# Altium project Abstract Hardware Device.PrjPcb
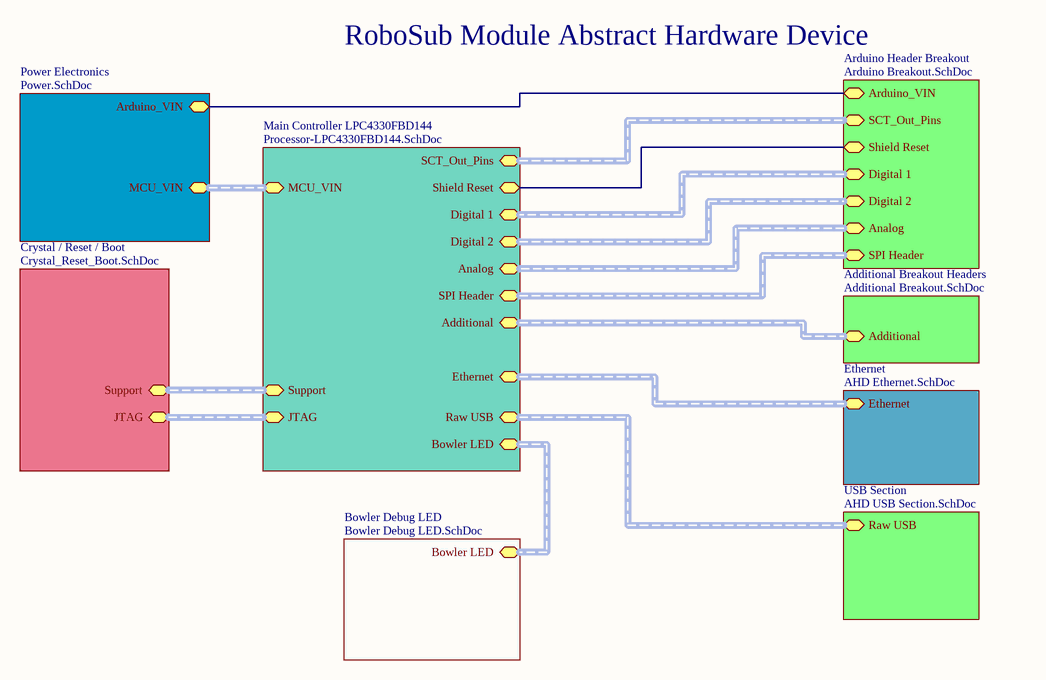
[diagram p0: AHD Master Schematic.SchDoc]
9 sheets, 162 parts. Net scope: hierarchical (ports join the sheet entries above them; power ports are global).
Board file: AHD PCB R2.4.PcbDoc
Sheets:
  AHD Master Schematic.SchDoc
    Power Electronics = Power.SchDoc
    Main Controller LPC4330FBD144 = Processor-LPC4330FBD144.SchDoc
    Arduino Header Breakout = Arduino Breakout.SchDoc
    Ethernet = AHD Ethernet.SchDoc
    Crystal / Reset / Boot = Crystal_Reset_Boot.SchDoc
    USB Section = AHD USB Section.SchDoc
    Bowler Debug LED = Bowler Debug LED.SchDoc
    Additional Breakout Headers = Additional Breakout.SchDoc

## Sheet AHD Master Schematic.SchDoc: Abstract Hardware Device Master Sheet
size A; DrawnBy: Adam Vadala-Roth; DocumentNumber: 1; Revision: 2.3b; SheetNumber: 1; SheetTotal: 9

### Sub-sheets
Additional Breakout Headers = Additional Breakout.SchDoc: Additional (harness Additional)
Arduino Header Breakout = Arduino Breakout.SchDoc: Analog (harness Analog), Digital 1 (harness Digital 1), Digital 2 (harness Digital 2), Arduino_VIN, SCT_Out_Pins (harness SCT_Out_Pins), SPI Header (harness SPI_Header), Shield Reset
Bowler Debug LED = Bowler Debug LED.SchDoc: Bowler LED (harness Bowler LED)
Crystal / Reset / Boot = Crystal_Reset_Boot.SchDoc: JTAG (harness JTAG), Support (harness Support)
Ethernet = AHD Ethernet.SchDoc: Ethernet (harness Ethernet)
Main Controller LPC4330FBD144 = Processor-LPC4330FBD144.SchDoc: Digital 2 (harness Digital 2), Digital 1 (harness Digital 1), Analog (harness Analog), Ethernet, JTAG (harness JTAG), MCU_VIN (harness MCU_VIN), Bowler LED (harness Bowler LED), Additional (harness Additional), SCT_Out_Pins (harness SCT_Out_Pins), SPI Header (harness SPI_Header), Support (harness Support), Raw USB (harness Raw USB), Shield Reset
Power Electronics = Power.SchDoc: MCU_VIN (harness MCU_VIN), Arduino_VIN
USB Section = AHD USB Section.SchDoc: Raw USB (harness Raw USB)

### Nets
VCC_IN: sheet Power Electronics/Arduino_VIN, sheet Arduino Header Breakout/Arduino_VIN
RESET: sheet Main Controller LPC4330FBD144/Shield Reset, sheet Arduino Header Breakout/Shield Reset

### Buses and harness runs
harness sheet Additional Breakout Headers/Additional = sheet Main Controller LPC4330FBD144/Additional
harness sheet Arduino Header Breakout/Analog = sheet Main Controller LPC4330FBD144/Analog
harness sheet Arduino Header Breakout/Digital 1 = sheet Main Controller LPC4330FBD144/Digital 1
harness sheet Arduino Header Breakout/Digital 2 = sheet Main Controller LPC4330FBD144/Digital 2
harness sheet Arduino Header Breakout/SCT_Out_Pins = sheet Main Controller LPC4330FBD144/SCT_Out_Pins
harness sheet Arduino Header Breakout/SPI Header = sheet Main Controller LPC4330FBD144/SPI Header
harness sheet Bowler Debug LED/Bowler LED = sheet Main Controller LPC4330FBD144/Bowler LED
harness sheet Crystal / Reset / Boot/JTAG = sheet Main Controller LPC4330FBD144/JTAG
harness sheet Crystal / Reset / Boot/Support = sheet Main Controller LPC4330FBD144/Support
harness sheet Ethernet/Ethernet = sheet Main Controller LPC4330FBD144/Ethernet
harness sheet Main Controller LPC4330FBD144/MCU_VIN = sheet Power Electronics/MCU_VIN
harness sheet Main Controller LPC4330FBD144/Raw USB = sheet USB Section/Raw USB

### Notes on the sheet
- RoboSub Module Abstract Hardware Device

## Sheet Power.SchDoc: Board Level Power
size A; DrawnBy: Adam Vadala-Roth; DocumentNumber: 4; Revision: 2.4b; SheetNumber: 4; SheetTotal: 9
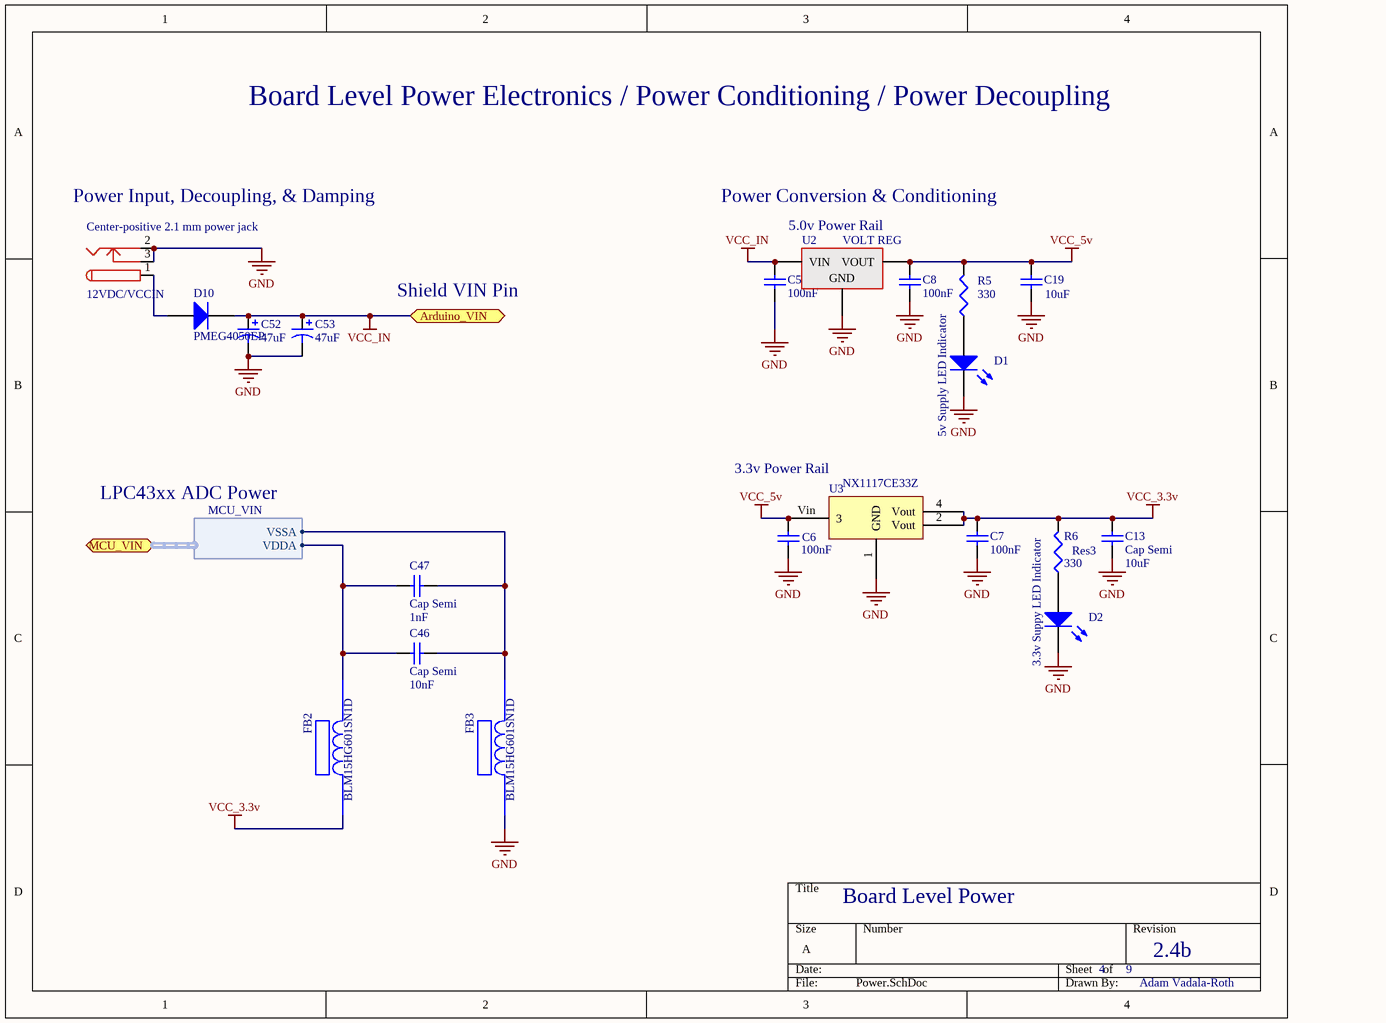
[diagram p1: Power.SchDoc]

### Parts
12VDC/VCCIN  Center-positive 2.1 mm power jack  [PJ-102AH]
C5  value 100nF  [C1206]  (hidden comment: Cap Semi)
C6  value 100nF  [C1206]  (hidden comment: Cap Semi)
C7  value 100nF  [C1206]  (hidden comment: Cap Semi)
C8  value 100nF  [C1206]  (hidden comment: Cap Semi)
C13  Cap Semi  value 10uF  [C1206]
C19  value 10uF  [C1206]  (hidden comment: Cap Semi)
C46  Cap Semi  value 10nF  [1608[0603]]
C47  Cap Semi  value 1nF  [1608[0603]]
C52  value 47uF  [CAPPR2.5-6.3x5]  (hidden comment: Cap Pol1)
C53  value 47uF  [CAPPR2.5-6.3x5]  (hidden comment: Cap Pol1)
D1  LED2  [3.2X1.6X1.1]  (value not drawn)
D2  LED2  [3.2X1.6X1.1]  (value not drawn)
D10  PMEG4050EP  [PMEG4050EP]
FB2  BLM15HG601SN1D  [BLM18PG121SN1D]
FB3  BLM15HG601SN1D  [BLM18PG121SN1D]
R5  value 330  [0805 SMD Resistor]  (hidden comment: Res3)
R6  Res3  value 330  [0805 SMD Resistor]
U2  VOLT REG  [DPAK-3]
U3  NX1117CE33Z  [NX1117CE33Z]

### Ports
Arduino_VIN, MCU_VIN (harness MCU_VIN)

### Harnesses
MCU_VIN: VDDA, VSSA

### Nets
GND: 12VDC/VCCIN.2 12VDC/VCCIN.3 C5.1 C6.1 C7.1 C8.1 C13.1 C19.1 C52.2 C53.2 D1.2(K) D2.2(K) FB3.1 U2.2(GND) U3.1(GND)
VCC_3.3v: C7.2 C13.2 FB2.1 R6.2 U3.2(Vout) U3.4(Vout)
VCC_5v: C6.2 C8.2 C19.2 R5.2 U2.3(VOUT) U3.Vin(3)
VCC_IN: C5.2 C52.1 C53.1 D10.2(K) U2.1(VIN) ; port Arduino_VIN
VDDA: C46.1 C47.1 FB2.2 ; port MCU_VIN.VDDA
VSSA: C46.2 C47.2 FB3.2 ; port MCU_VIN.VSSA
Net12VDC/VCCIN_1: 12VDC/VCCIN.1 D10.1(A)
NetD1_1: D1.1(A) R5.1
NetD2_1: D2.1(A) R6.1

### Notes on the sheet
- Board Level Power Electronics / Power Conditioning / Power Decoupling
- (near 12VDC/VCCIN) Power Input, Decoupling, & Damping
- Power Conversion & Conditioning
- 5.0v Power Rail
- Shield VIN Pin
- 5v Supply LED Indicator
- LPC43xx ADC Power
- 3.3v Power Rail
- 3.3v Suppy LED Indicator

### Library data of the parts
12VDC/VCCIN = PWR2.5: Power jack; Published: 17-Dec-2003; DatasheetDocument: 09-May-2002; Publisher: Altium Limited; ComponentLink1Description: Manufacturer Link; ComponentLink1URL: http://domino.kycon.com/internet/Products.html
C5-C8 C13 C19 C46 C47 = Cap Semi: Capacitor (Semiconductor SIM Model); Published: 8-Jun-2000; LatestRevisionDate: 29-May-2009; LatestRevisionNote: IPC-7351 Footprint Added.; PackageReference: C1206; Publisher: Altium Limited; PackageDescription: Chip Capacitor
C52 C53 = Cap Pol1: Polarized Capacitor (Radial); Published: 8-Jun-2000; LatestRevisionDate: 17-Jul-2002; LatestRevisionNote: Re-released for DXP Platform.; PackageReference: RB7.6-15; Publisher: Altium Limited; PackageDescription: Polarized Capacitor (Radial); 2 Leads
D1 D2 = LED2: Typical RED, GREEN, YELLOW, AMBER GaAs LED; Published: 8-Jun-2000; LatestRevisionDate: 17-Jul-2002; LatestRevisionNote: Re-released for DXP Platform.; PackageVersion: Feb-2002; PackageReference: 3.2X1.6X1.1; Publisher: Altium Limited; PackageDescription: SM LED; 2 Flat Leads
D10 = Diode: Default Diode; Published: 8-Jun-2000; LatestRevisionDate: 17-Jul-2002; LatestRevisionNote: Re-released for DXP Platform.; PackageVersion: Sep-1996; PackageReference: SMC; Publisher: Altium Limited; PackageDescription: DO-214-AB/SMC; 2 C-Bend Leads; Body 7.9 x 5.9 mm, inc. leads (LxW); Code_JEDEC: DO-214-AB
R5 R6 = Res3: Resistor; Published: 8-Jun-2000; LatestRevisionDate: 29-May-2009; LatestRevisionNote: IPC-7351 Footprint Added.; PackageReference: J1-0603; Publisher: Altium Limited; PackageDescription: Chip Resistor
U2 = VOLT REG: Voltage regulator; Published: 24-Mar-1999; LatestRevisionDate: 29-May-2009; LatestRevisionNote: IPC-7351 Footprint Added.; PackageReference: D2PAK; Publisher: Altium Limited; PackageDescription: 3-Pin Transistor Outline Package 2.54 mm Pitch, 15.1 mm Lead Span
U3 = NX1117CE33Z: 3.3v Linear Regulator

## Sheet Processor-LPC4330FBD144.SchDoc: Main Processor LPC43xx (144 TQFPT)
size C; DrawnBy: Adam Vadala-Roth; DocumentNumber: 2; Revision: 2.4b; SheetNumber: 2; SheetTotal: 9; PageSetup: Record=PageOptions|CenterHorizontal=True|CenterVertical=True|PrintScale=1.00|XCorrection=1.00|YCorrection=1.00|PrintKind=1|BorderSize=5000000|LeftOffset=0|BottomOffset=0|Orientation=2|PaperLength=1000|PaperWidth=1000|Scale=100|PaperSource=7|PrintQuality=-4|MediaType=1|DitherType=10|PaperKind=Letter|PrintScaleMode=0
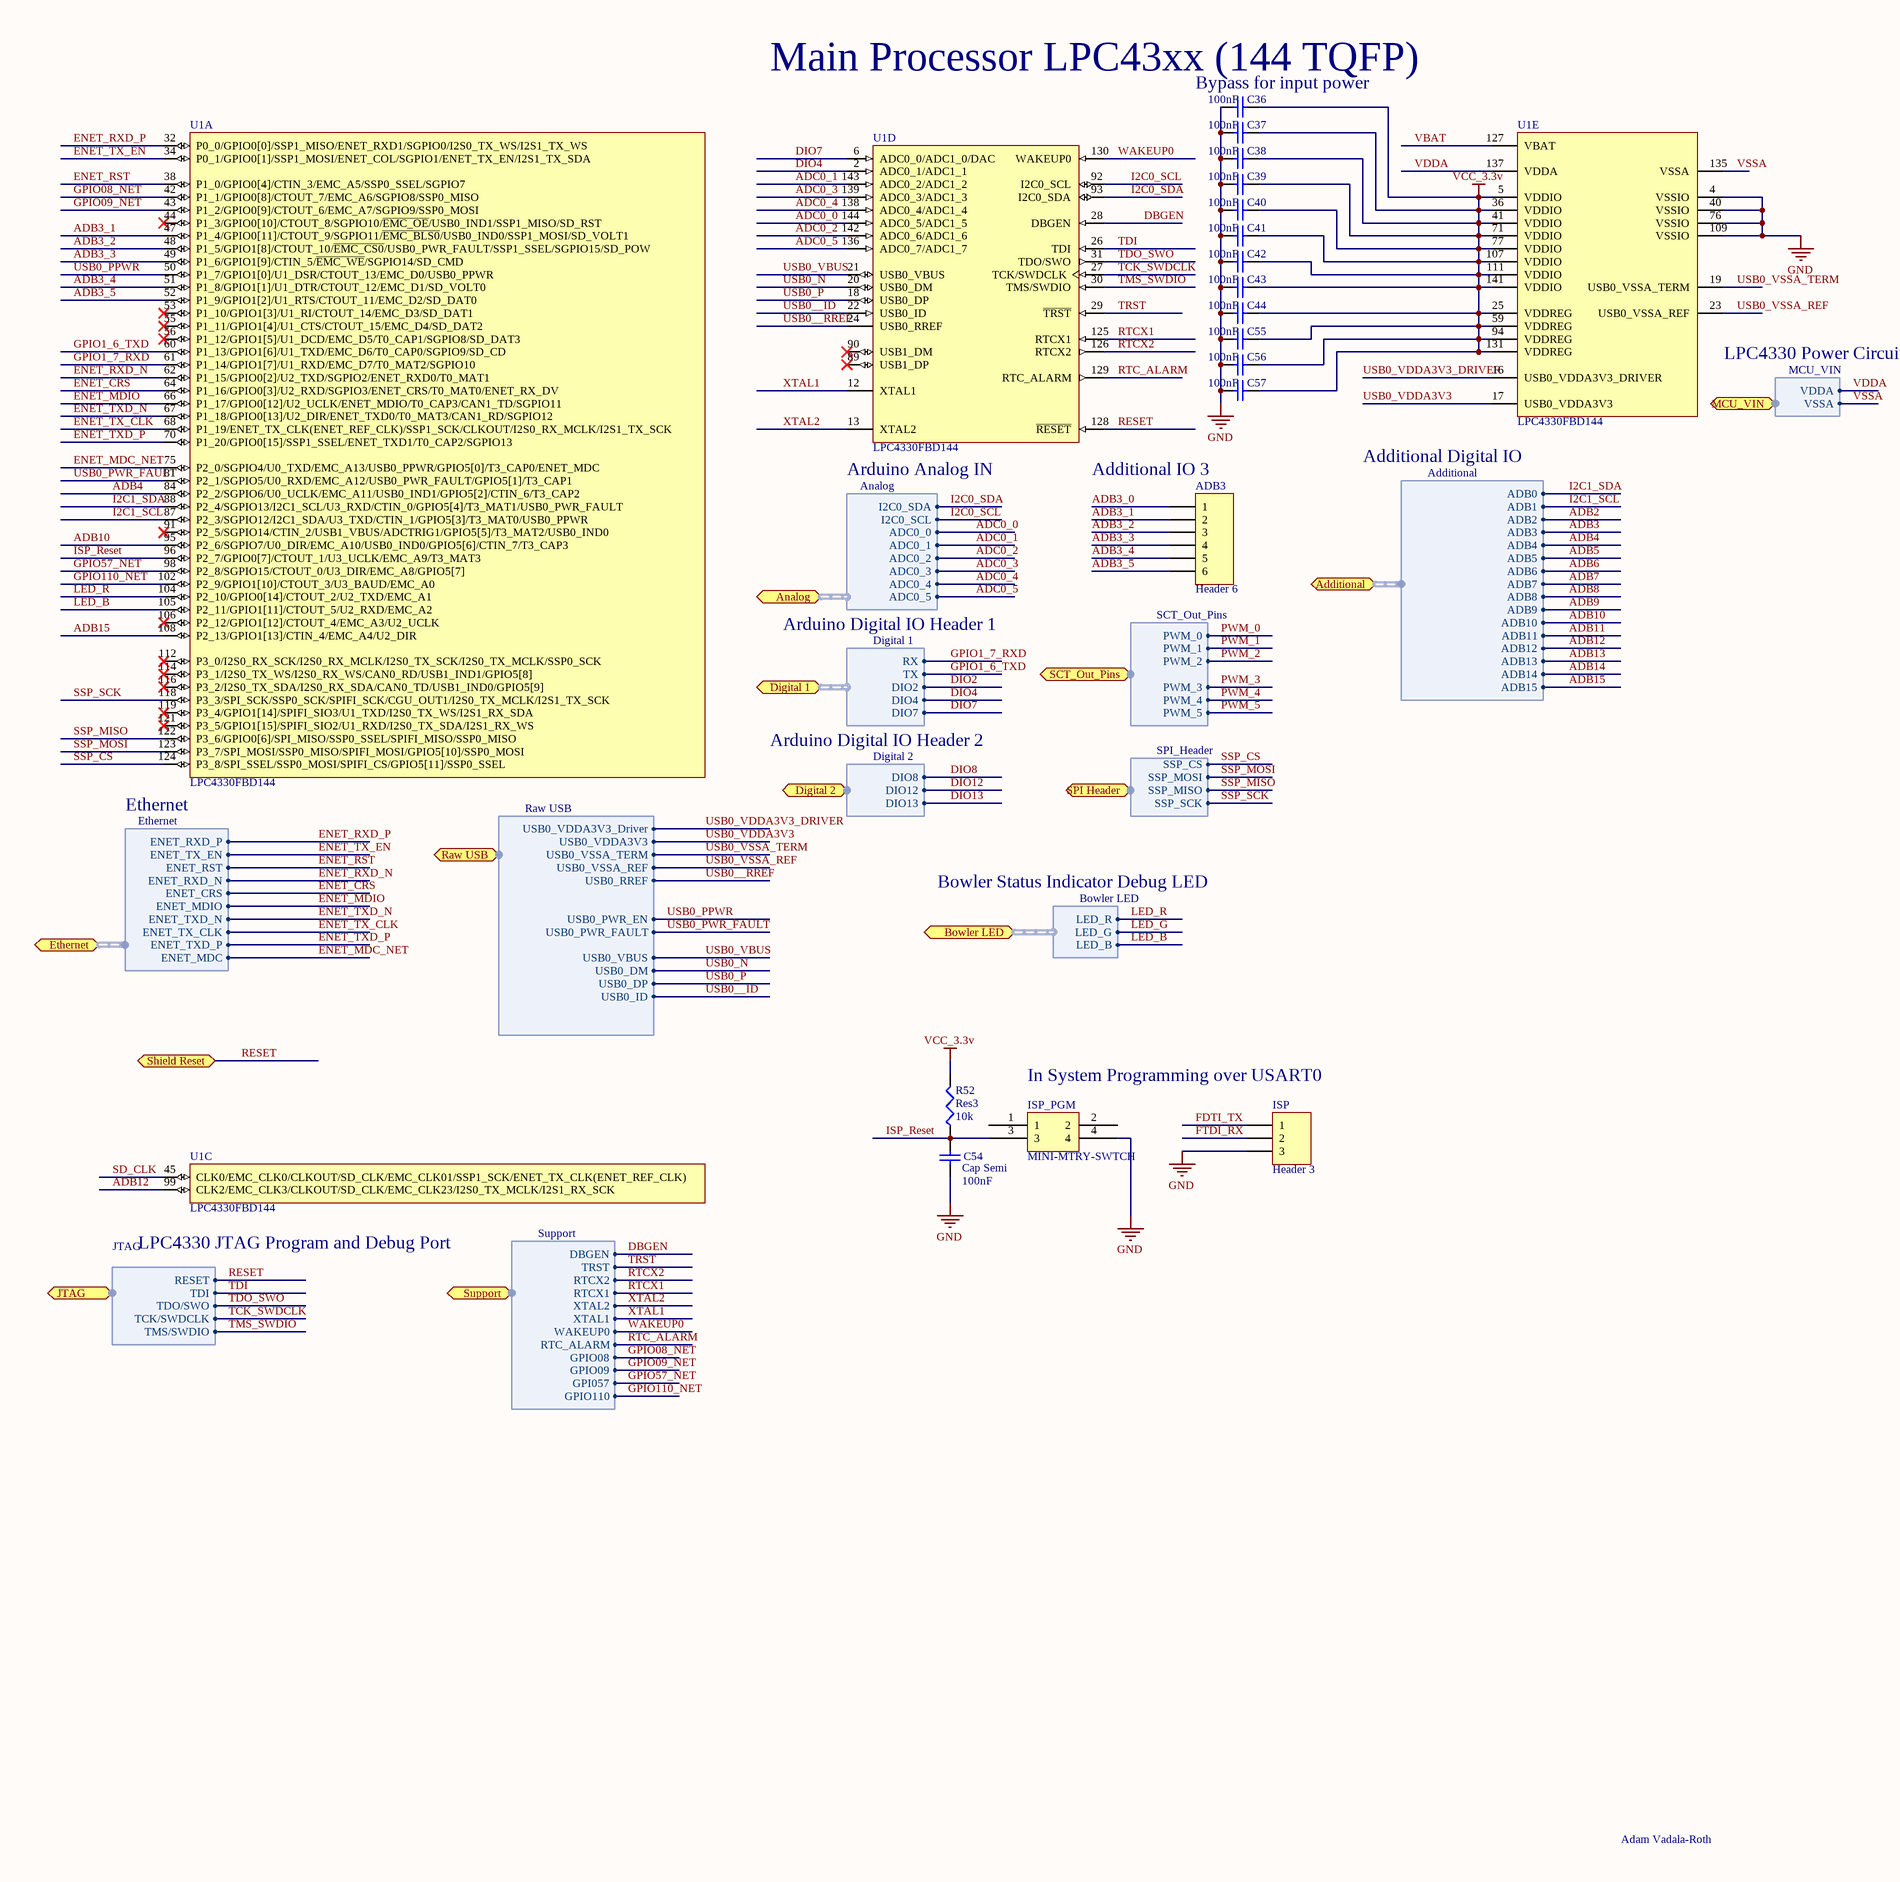
[diagram p2: Processor-LPC4330FBD144.SchDoc, left]
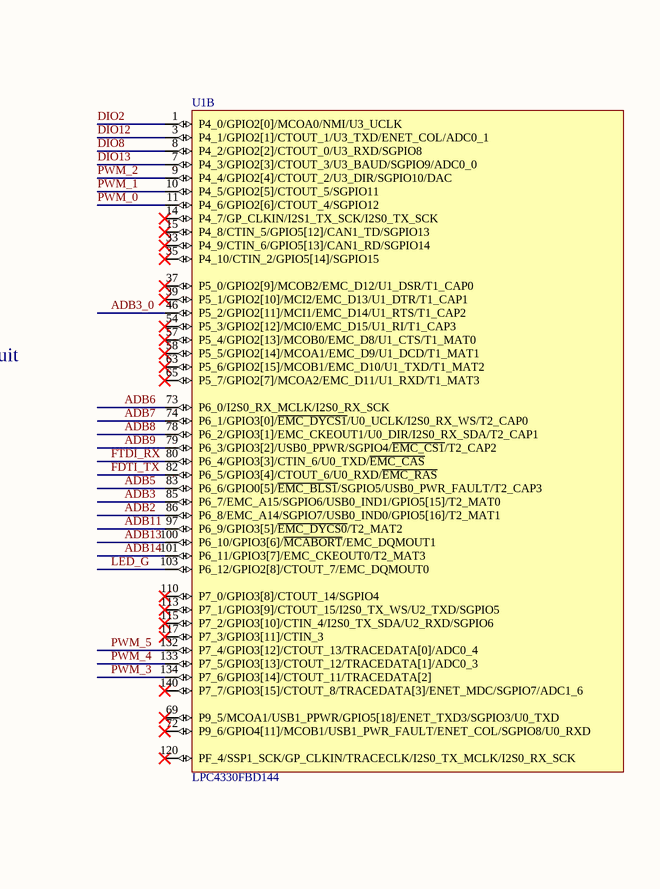
[diagram p3: Processor-LPC4330FBD144.SchDoc, right]

### Parts
ADB3  Header 6  [HDR1X6]
C36  value 100nF  [1608[0603]]  (hidden comment: Cap Semi)
C37  value 100nF  [1608[0603]]  (hidden comment: Cap Semi)
C38  value 100nF  [1608[0603]]  (hidden comment: Cap Semi)
C39  value 100nF  [1608[0603]]  (hidden comment: Cap Semi)
C40  value 100nF  [1608[0603]]  (hidden comment: Cap Semi)
C41  value 100nF  [1608[0603]]  (hidden comment: Cap Semi)
C42  value 100nF  [1608[0603]]  (hidden comment: Cap Semi)
C43  value 100nF  [1608[0603]]  (hidden comment: Cap Semi)
C44  value 100nF  [1608[0603]]  (hidden comment: Cap Semi)
C54  Cap Semi  C1: 100nF  [CAPC1608L]
C55  value 100nF  [1608[0603]]  (hidden comment: Cap Semi)
C56  value 100nF  [1608[0603]]  (hidden comment: Cap Semi)
C57  value 100nF  [1608[0603]]  (hidden comment: Cap Semi)
ISP  Header 3  [HDR1X3]
ISP_PGM  MINI-MTRY-SWTCH  [Momentary Switch]
R52  Res3  value 10k  [J1-0603]
U1  LPC4330FBD144  [SOT486-1_V]  (parts A,B,C,D,E of 5)

### Ports
Additional (harness Additional), Analog (harness Analog), Bowler LED (harness Bowler LED), Digital 1 (harness Digital 1), Digital 2 (harness Digital 2), Ethernet (harness Ethernet), JTAG (harness JTAG), MCU_VIN (harness MCU_VIN), Raw USB (harness Raw USB), SCT_Out_Pins (harness SCT_Out_Pins), Shield Reset, SPI Header (harness SPI_Header), Support (harness Support)

### Harnesses
Analog: ADC0_0, ADC0_1, ADC0_2, ADC0_3, ADC0_4, ADC0_5, I2C0_SCL, I2C0_SDA
Digital 1: TX, RX, DIO2, DIO4, DIO7
Digital 2: DIO8, DIO13, DIO12
MCU_VIN: VDDA, VSSA
Bowler LED: LED_R, LED_G, LED_B
SCT_Out_Pins: PWM_0, PWM_1, PWM_2, PWM_3, PWM_4, PWM_5
SPI_Header: SSP_CS, SSP_MOSI, SSP_MISO, SSP_SCK
JTAG: TDI, TDO/SWO, TCK/SWDCLK, TMS/SWDIO, RESET
Support: GPIO08, GPIO09, GPI057, GPIO110, RTC_ALARM, WAKEUP0, XTAL2, XTAL1, RTCX2, RTCX1, TRST, DBGEN
Additional: ADB0, ADB1, ADB2, ADB3, ADB4, ADB6, ADB5, ADB7, ADB9, ADB8, ADB10, ADB11, ADB12, ADB13, ADB14, ADB15
Raw USB: USB0_VDDA3V3_Driver, USB0_VDDA3V3, USB0_VSSA_TERM, USB0_VSSA_REF, USB0_VBUS, USB0_DP, USB0_DM, USB0_ID, USB0_RREF, USB0_PWR_EN, USB0_PWR_FAULT
Ethernet: ENET_RXD_P, ENET_TX_EN, ENET_RST, ENET_TXD_P, ENET_MDC, ENET_RXD_N, ENET_CRS, ENET_MDIO, ENET_TXD_N, ENET_TX_CLK

### Nets
GND: C36.2 C37.2 C38.2 C39.1 C40.2 C41.1 C42.2 C43.2 C44.2 C54.1 C55.2 C56.2 C57.2 ISP.3 ISP_PGM.4 U1.4(VSSIO) U1.40(VSSIO) U1.76(VSSIO) U1.109(VSSIO)
VCC_3.3v: C36.1 C37.1 C38.1 C39.2 C40.1 C41.2 C42.1 C43.1 C44.1 C55.1 C56.1 C57.1 R52.2 U1.5(VDDIO) U1.25(VDDREG) U1.36(VDDIO) U1.41(VDDIO) U1.59(VDDREG) U1.71(VDDIO) U1.77(VDDIO) U1.94(VDDREG) U1.107(VDDIO) U1.111(VDDIO) U1.131(VDDREG) U1.141(VDDIO)
ADB2: U1.86(P6_8/EMC_A14/SGPIO7/USB0_IND0/GPIO5[16]/T2_MAT1) ; port Additional.ADB2
ADB3: U1.85(P6_7/EMC_A15/SGPIO6/USB0_IND1/GPIO5[15]/T2_MAT0) ; port Additional.ADB3
ADB3_0: ADB3.1 U1.46(P5_2/GPIO2[11]/MCI1/EMC_D14/U1_RTS/T1_CAP2)
ADB3_1: ADB3.2 U1.47(P1_4/GPIO0[11]/CTOUT_9/SGPIO11/~{EMC_BLS0}/USB0_IND0/SSP1_MOSI/SD_VOLT1)
ADB3_2: ADB3.3 U1.48(P1_5/GPIO1[8]/CTOUT_10/~{EMC_CS0}/USB0_PWR_FAULT/SSP1_SSEL/SGPIO15/SD_POW)
ADB3_3: ADB3.4 U1.49(P1_6/GPIO1[9]/CTIN_5/~{EMC_WE}/SGPIO14/SD_CMD)
ADB3_4: ADB3.5 U1.51(P1_8/GPIO1[1]/U1_DTR/CTOUT_12/EMC_D1/SD_VOLT0)
ADB3_5: ADB3.6 U1.52(P1_9/GPIO1[2]/U1_RTS/CTOUT_11/EMC_D2/SD_DAT0)
ADB4: U1.84(P2_2/SGPIO6/U0_UCLK/EMC_A11/USB0_IND1/GPIO5[2]/CTIN_6/T3_CAP2) ; port Additional.ADB4
ADB5: U1.83(P6_6/GPIO0[5]/~{EMC_BLS1}/SGPIO5/USB0_PWR_FAULT/T2_CAP3) ; port Additional.ADB5
ADB6: U1.73(P6_0/I2S0_RX_MCLK/I2S0_RX_SCK) ; port Additional.ADB6
ADB7: U1.74(P6_1/GPIO3[0]/~{EMC_DYCS1}/U0_UCLK/I2S0_RX_WS/T2_CAP0) ; port Additional.ADB7
ADB8: U1.78(P6_2/GPIO3[1]/EMC_CKEOUT1/U0_DIR/I2S0_RX_SDA/T2_CAP1) ; port Additional.ADB8
ADB9: U1.79(P6_3/GPIO3[2]/USB0_PPWR/SGPIO4/~{EMC_CS1}/T2_CAP2) ; port Additional.ADB9
ADB10: U1.95(P2_6/SGPIO7/U0_DIR/EMC_A10/USB0_IND0/GPIO5[6]/CTIN_7/T3_CAP3) ; port Additional.ADB10
ADB11: U1.97(P6_9/GPIO3[5]/~{EMC_DYCS0}/T2_MAT2) ; port Additional.ADB11
ADB12: U1.99(CLK2/EMC_CLK3/CLKOUT/SD_CLK/EMC_CLK23/I2S0_TX_MCLK/I2S1_RX_SCK) ; port Additional.ADB12
ADB13: U1.100(P6_10/GPIO3[6]/~{MCABORT}/EMC_DQMOUT1) ; port Additional.ADB13
ADB14: U1.101(P6_11/GPIO3[7]/EMC_CKEOUT0/T2_MAT3) ; port Additional.ADB14
ADB15: U1.108(P2_13/GPIO1[13]/CTIN_4/EMC_A4/U2_DIR) ; port Additional.ADB15
ADC0_0: U1.144(ADC0_5/ADC1_5) ; port Analog.ADC0_0
ADC0_1: U1.143(ADC0_2/ADC1_2) ; port Analog.ADC0_1
ADC0_2: U1.142(ADC0_6/ADC1_6) ; port Analog.ADC0_2
ADC0_3: U1.139(ADC0_3/ADC1_3) ; port Analog.ADC0_3
ADC0_4: U1.138(ADC0_4/ADC1_4) ; port Analog.ADC0_4
ADC0_5: U1.136(ADC0_7/ADC1_7) ; port Analog.ADC0_5
DBGEN: U1.28(DBGEN) ; port Support.DBGEN
DIO2: U1.1(P4_0/GPIO2[0]/MCOA0/NMI/U3_UCLK) ; port Digital 1.DIO2
DIO4: U1.2(ADC0_1/ADC1_1) ; port Digital 1.DIO4
DIO7: U1.6(ADC0_0/ADC1_0/DAC) ; port Digital 1.DIO7
DIO8: U1.8(P4_2/GPIO2[2]/CTOUT_0/U3_RXD/SGPIO8) ; port Digital 2.DIO8
DIO12: U1.3(P4_1/GPIO2[1]/CTOUT_1/U3_TXD/ENET_COL/ADC0_1) ; port Digital 2.DIO12
DIO13: U1.7(P4_3/GPIO2[3]/CTOUT_3/U3_BAUD/SGPIO9/ADC0_0) ; port Digital 2.DIO13
ENET_CRS: U1.64(P1_16/GPIO0[3]/U2_RXD/SGPIO3/ENET_CRS/T0_MAT0/ENET_RX_DV) ; port Ethernet.ENET_CRS
ENET_MDC_NET: U1.75(P2_0/SGPIO4/U0_TXD/EMC_A13/USB0_PPWR/GPIO5[0]/T3_CAP0/ENET_MDC) ; port Ethernet.ENET_MDC
ENET_MDIO: U1.66(P1_17/GPIO0[12]/U2_UCLK/ENET_MDIO/T0_CAP3/CAN1_TD/SGPIO11) ; port Ethernet.ENET_MDIO
ENET_RST: U1.38(P1_0/GPIO0[4]/CTIN_3/EMC_A5/SSP0_SSEL/SGPIO7) ; port Ethernet.ENET_RST
ENET_RXD_N: U1.62(P1_15/GPIO0[2]/U2_TXD/SGPIO2/ENET_RXD0/T0_MAT1) ; port Ethernet.ENET_RXD_N
ENET_RXD_P: U1.32(P0_0/GPIO0[0]/SSP1_MISO/ENET_RXD1/SGPIO0/I2S0_TX_WS/I2S1_TX_WS) ; port Ethernet.ENET_RXD_P
ENET_TX_CLK: U1.68(P1_19/ENET_TX_CLK(ENET_REF_CLK)/SSP1_SCK/CLKOUT/I2S0_RX_MCLK/I2S1_TX_SCK) ; port Ethernet.ENET_TX_CLK
ENET_TX_EN: U1.34(P0_1/GPIO0[1]/SSP1_MOSI/ENET_COL/SGPIO1/ENET_TX_EN/I2S1_TX_SDA) ; port Ethernet.ENET_TX_EN
ENET_TXD_N: U1.67(P1_18/GPIO0[13]/U2_DIR/ENET_TXD0/T0_MAT3/CAN1_RD/SGPIO12) ; port Ethernet.ENET_TXD_N
ENET_TXD_P: U1.70(P1_20/GPIO0[15]/SSP1_SSEL/ENET_TXD1/T0_CAP2/SGPIO13) ; port Ethernet.ENET_TXD_P
FDTI_TX: ISP.1 U1.82(P6_5/GPIO3[4]/CTOUT_6/U0_RXD/~{EMC_RAS})
FTDI_RX: ISP.2 U1.80(P6_4/GPIO3[3]/CTIN_6/U0_TXD/~{EMC_CAS})
GPIO1_6_TXD: U1.60(P1_13/GPIO1[6]/U1_TXD/EMC_D6/T0_CAP0/SGPIO9/SD_CD) ; port Digital 1.TX
GPIO1_7_RXD: U1.61(P1_14/GPIO1[7]/U1_RXD/EMC_D7/T0_MAT2/SGPIO10) ; port Digital 1.RX
GPIO08_NET: U1.42(P1_1/GPIO0[8]/CTOUT_7/EMC_A6/SGPIO8/SSP0_MISO) ; port Support.GPIO08
GPIO09_NET: U1.43(P1_2/GPIO0[9]/CTOUT_6/EMC_A7/SGPIO9/SSP0_MOSI) ; port Support.GPIO09
GPIO57_NET: U1.98(P2_8/SGPIO15/CTOUT_0/U3_DIR/EMC_A8/GPIO5[7]) ; port Support.GPI057
GPIO110_NET: U1.102(P2_9/GPIO1[10]/CTOUT_3/U3_BAUD/EMC_A0) ; port Support.GPIO110
I2C0_SCL: U1.92(I2C0_SCL) ; port Analog.I2C0_SCL  [project net A5_SCL]
I2C0_SDA: U1.93(I2C0_SDA) ; port Analog.I2C0_SDA  [project net A4_SDA]
I2C1_SCL: U1.87(P2_3/SGPIO12/I2C1_SDA/U3_TXD/CTIN_1/GPIO5[3]/T3_MAT0/USB0_PPWR) ; port Additional.ADB1
I2C1_SDA: U1.88(P2_4/SGPIO13/I2C1_SCL/U3_RXD/CTIN_0/GPIO5[4]/T3_MAT1/USB0_PWR_FAULT) ; port Additional.ADB0
ISP_Reset: C54.2 ISP_PGM.3 R52.1 U1.96(P2_7/GPIO0[7]/CTOUT_1/U3_UCLK/EMC_A9/T3_MAT3)
LED_B: U1.105(P2_11/GPIO1[11]/CTOUT_5/U2_RXD/EMC_A2) ; port Bowler LED.LED_B
LED_G: U1.103(P6_12/GPIO2[8]/CTOUT_7/EMC_DQMOUT0) ; port Bowler LED.LED_G
LED_R: U1.104(P2_10/GPIO0[14]/CTOUT_2/U2_TXD/EMC_A1) ; port Bowler LED.LED_R
PWM_0: U1.11(P4_6/GPIO2[6]/CTOUT_4/SGPIO12) ; port SCT_Out_Pins.PWM_0
PWM_1: U1.10(P4_5/GPIO2[5]/CTOUT_5/SGPIO11) ; port SCT_Out_Pins.PWM_1
PWM_2: U1.9(P4_4/GPIO2[4]/CTOUT_2/U3_DIR/SGPIO10/DAC) ; port SCT_Out_Pins.PWM_2
PWM_3: U1.134(P7_6/GPIO3[14]/CTOUT_11/TRACEDATA[2]) ; port SCT_Out_Pins.PWM_3
PWM_4: U1.133(P7_5/GPIO3[13]/CTOUT_12/TRACEDATA[1]/ADC0_3) ; port SCT_Out_Pins.PWM_4
PWM_5: U1.132(P7_4/GPIO3[12]/CTOUT_13/TRACEDATA[0]/ADC0_4) ; port SCT_Out_Pins.PWM_5
RESET: U1.128(~{RESET}) ; port Shield Reset, port JTAG.RESET
RTC_ALARM: U1.129(RTC_ALARM) ; port Support.RTC_ALARM
RTCX1: U1.125(RTCX1) ; port Support.RTCX1
RTCX2: U1.126(RTCX2) ; port Support.RTCX2
SD_CLK: U1.45(CLK0/EMC_CLK0/CLKOUT/SD_CLK/EMC_CLK01/SSP1_SCK/ENET_TX_CLK(ENET_REF_CLK))
SSP_CS: U1.124(P3_8/SPI_SSEL/SSP0_MOSI/SPIFI_CS/GPIO5[11]/SSP0_SSEL) ; port SPI Header.SSP_CS  [project net CS]
SSP_MISO: U1.122(P3_6/GPIO0[6]/SPI_MISO/SSP0_SSEL/SPIFI_MISO/SSP0_MISO) ; port SPI Header.SSP_MISO  [project net MISO]
SSP_MOSI: U1.123(P3_7/SPI_MOSI/SSP0_MISO/SPIFI_MOSI/GPIO5[10]/SSP0_MOSI) ; port SPI Header.SSP_MOSI
SSP_SCK: U1.118(P3_3/SPI_SCK/SSP0_SCK/SPIFI_SCK/CGU_OUT1/I2S0_TX_MCLK/I2S1_TX_SCK) ; port SPI Header.SSP_SCK  [project net SCK]
TCK_SWDCLK: U1.27(TCK/SWDCLK) ; port JTAG.TCK/SWDCLK
TDI: U1.26(TDI) ; port JTAG.TDI
TDO_SWO: U1.31(TDO/SWO) ; port JTAG.TDO/SWO
TMS_SWDIO: U1.30(TMS/SWDIO) ; port JTAG.TMS/SWDIO
TRST: U1.29(~{TRST}) ; port Support.TRST
USB0__ID: U1.22(USB0_ID) ; port Raw USB.USB0_ID
USB0__RREF: U1.24(USB0_RREF) ; port Raw USB.USB0_RREF
USB0_N: U1.20(USB0_DM) ; port Raw USB.USB0_DM
USB0_P: U1.18(USB0_DP) ; port Raw USB.USB0_DP
USB0_PPWR: U1.50(P1_7/GPIO1[0]/U1_DSR/CTOUT_13/EMC_D0/USB0_PPWR) ; port Raw USB.USB0_PWR_EN
USB0_PWR_FAULT: U1.81(P2_1/SGPIO5/U0_RXD/EMC_A12/USB0_PWR_FAULT/GPIO5[1]/T3_CAP1) ; port Raw USB.USB0_PWR_FAULT
USB0_VBUS: U1.21(USB0_VBUS) ; port Raw USB.USB0_VBUS
USB0_VDDA3V3: U1.16(USB0_VDDA3V3_DRIVER) U1.17(USB0_VDDA3V3) ; port Raw USB.USB0_VDDA3V3_Driver, port Raw USB.USB0_VDDA3V3  [also labelled USB0_VDDA3V3_DRIVER]  [project net USB0_VDDA]
USB0_VSSA_REF: U1.19(USB0_VSSA_TERM) U1.23(USB0_VSSA_REF) ; port Raw USB.USB0_VSSA_TERM, port Raw USB.USB0_VSSA_REF  [also labelled USB0_VSSA_TERM]
VBAT: U1.127(VBAT)
VDDA: U1.137(VDDA) ; port MCU_VIN.VDDA
VSSA: U1.135(VSSA) ; port MCU_VIN.VSSA
WAKEUP0: U1.130(WAKEUP0) ; port Support.WAKEUP0
XTAL1: U1.12(XTAL1) ; port Support.XTAL1
XTAL2: U1.13(XTAL2) ; port Support.XTAL2

Not connected (* = marked no-connect by the designer): ISP_PGM 1 2; U1 14(P4_7/GP_CLKIN/I2S1_TX_SCK/I2S0_TX_SCK)* 15(P4_8/CTIN_5/GPIO5[12]/CAN1_TD/SGPIO13)* 33(P4_9/CTIN_6/GPIO5[13]/CAN1_RD/SGPIO14)* 35(P4_10/CTIN_2/GPIO5[14]/SGPIO15)* 37(P5_0/GPIO2[9]/MCOB2/EMC_D12/U1_DSR/T1_CAP0)* 39(P5_1/GPIO2[10]/MCI2/EMC_D13/U1_DTR/T1_CAP1)* 44(P1_3/GPIO0[10]/CTOUT_8/SGPIO10/~{EMC_OE}/USB0_IND1/SSP1_MISO/SD_RST)* 53(P1_10/GPIO1[3]/U1_RI/CTOUT_14/EMC_D3/SD_DAT1)* 54(P5_3/GPIO2[12]/MCI0/EMC_D15/U1_RI/T1_CAP3)* 55(P1_11/GPIO1[4]/U1_CTS/CTOUT_15/EMC_D4/SD_DAT2)* 56(P1_12/GPIO1[5]/U1_DCD/EMC_D5/T0_CAP1/SGPIO8/SD_DAT3)* 57(P5_4/GPIO2[13]/MCOB0/EMC_D8/U1_CTS/T1_MAT0)* 58(P5_5/GPIO2[14]/MCOA1/EMC_D9/U1_DCD/T1_MAT1)* 63(P5_6/GPIO2[15]/MCOB1/EMC_D10/U1_TXD/T1_MAT2)* 65(P5_7/GPIO2[7]/MCOA2/EMC_D11/U1_RXD/T1_MAT3)* 69(P9_5/MCOA1/USB1_PPWR/GPIO5[18]/ENET_TXD3/SGPIO3/U0_TXD)* 72(P9_6/GPIO4[11]/MCOB1/USB1_PWR_FAULT/ENET_COL/SGPIO8/U0_RXD)* 89(USB1_DP)* 90(USB1_DM)* 91(P2_5/SGPIO14/CTIN_2/USB1_VBUS/ADCTRIG1/GPIO5[5]/T3_MAT2/USB0_IND0)* 106(P2_12/GPIO1[12]/CTOUT_4/EMC_A3/U2_UCLK)* 110(P7_0/GPIO3[8]/CTOUT_14/SGPIO4)* 112(P3_0/I2S0_RX_SCK/I2S0_RX_MCLK/I2S0_TX_SCK/I2S0_TX_MCLK/SSP0_SCK)* 113(P7_1/GPIO3[9]/CTOUT_15/I2S0_TX_WS/U2_TXD/SGPIO5)* 114(P3_1/I2S0_TX_WS/I2S0_RX_WS/CAN0_RD/USB1_IND1/GPIO5[8])* 115(P7_2/GPIO3[10]/CTIN_4/I2S0_TX_SDA/U2_RXD/SGPIO6)* 116(P3_2/I2S0_TX_SDA/I2S0_RX_SDA/CAN0_TD/USB1_IND0/GPIO5[9])* 117(P7_3/GPIO3[11]/CTIN_3)* 119(P3_4/GPIO1[14]/SPIFI_SIO3/U1_TXD/I2S0_TX_WS/I2S1_RX_SDA)* 120(PF_4/SSP1_SCK/GP_CLKIN/TRACECLK/I2S0_TX_MCLK/I2S0_RX_SCK)* 121(P3_5/GPIO1[15]/SPIFI_SIO2/U1_RXD/I2S0_TX_SDA/I2S1_RX_WS)* 140(P7_7/GPIO3[15]/CTOUT_8/TRACEDATA[3]/ENET_MDC/SGPIO7/ADC1_6)*

### Notes on the sheet
- (near C36) Main Processor LPC43xx (144 TQFP)
- (near C36) Bypass for input power
- (near U1) LPC4330 Power Circuit
- (near U1) Additional Digital IO
- (near U1) Arduino Analog IN
- Additional IO 3
- Arduino Digital IO Header 1
- Arduino Digital IO Header 2
- (near U1) Ethernet
- Bowler Status Indicator Debug LED
- In System Programming over USART0
- (near U1) LPC4330 JTAG Program and Debug Port
- Adam Vadala-Roth
- Title
- Size:
- Date:
- B
- Number:
- Time:
- Revision:
- Sheet
- of
- File:

### Library data of the parts
ADB3 = Header 6: Header, 6-Pin; LatestRevisionDate: 17-Jul-2002; LatestRevisionNote: Re-released for DXP Platform.; Publisher: Altium Limited
C36-C44 C54-C57 = Cap Semi: Capacitor (Semiconductor SIM Model); Published: 8-Jun-2000; LatestRevisionDate: 29-May-2009; LatestRevisionNote: IPC-7351 Footprint Added.; PackageReference: C1206; Publisher: Altium Limited; PackageDescription: Chip Capacitor
ISP = Header 3: Header, 3-Pin; LatestRevisionDate: 17-Jul-2002; LatestRevisionNote: Re-released for DXP Platform.; Publisher: Altium Limited
ISP_PGM = Mini Momemtary Switch
R52 = Res3: Resistor; Published: 8-Jun-2000; LatestRevisionDate: 29-May-2009; LatestRevisionNote: IPC-7351 Footprint Added.; PackageReference: J1-0603; Publisher: Altium Limited; PackageDescription: Chip Resistor
U1 = LPC4330FBD144: 32-bit ARM Cortex-M4 MCU, 264 kB SRAM, 2 HS USB with on-chip PHY, Ethernet, CAN, AES, SPIFI, SGPIO, SCT, 144-Pin LQFP; fmax: 204 MHz; GPIOs: 83; SRAM: 264 kB; ROM: 64 kB; Ethernet: Y; USB: 2; ADC channels: 8; SPI: 1; UART: 4; VDD (min): 2.2 V; VDD (max): 3.6 V; Code_IEC: 136E23; DatasheetVersion: Rev.3.1, Jan-2012; PackageVersion: Feb-2003; PackageReference: SOT486-1; PackageDescription: LQFP144: Plastic Low Profile Quad Flat Package; 144 Leads; Body 20 x 20 x 1.4 mm; PWM: Y; PLL: Y; I2C: 2; CAN: 2; Timers: 4; Code_JEDEC: MS-026; ComponentLink1Description: Manufacturer URL; ComponentLink1URL: http://www.nxp.com/; ComponentLink2Description: Datasheet; ComponentLink2URL: http://www.nxp.com/documents/data_sheet/LPC4350_30_20_10.pdf

## Sheet Arduino Breakout.SchDoc: Arduino Leonardo Headers
size A; DrawnBy: Adam Vadala-Roth; DocumentNumber: 8; Revision: 2.4b; SheetNumber: 8; SheetTotal: 9
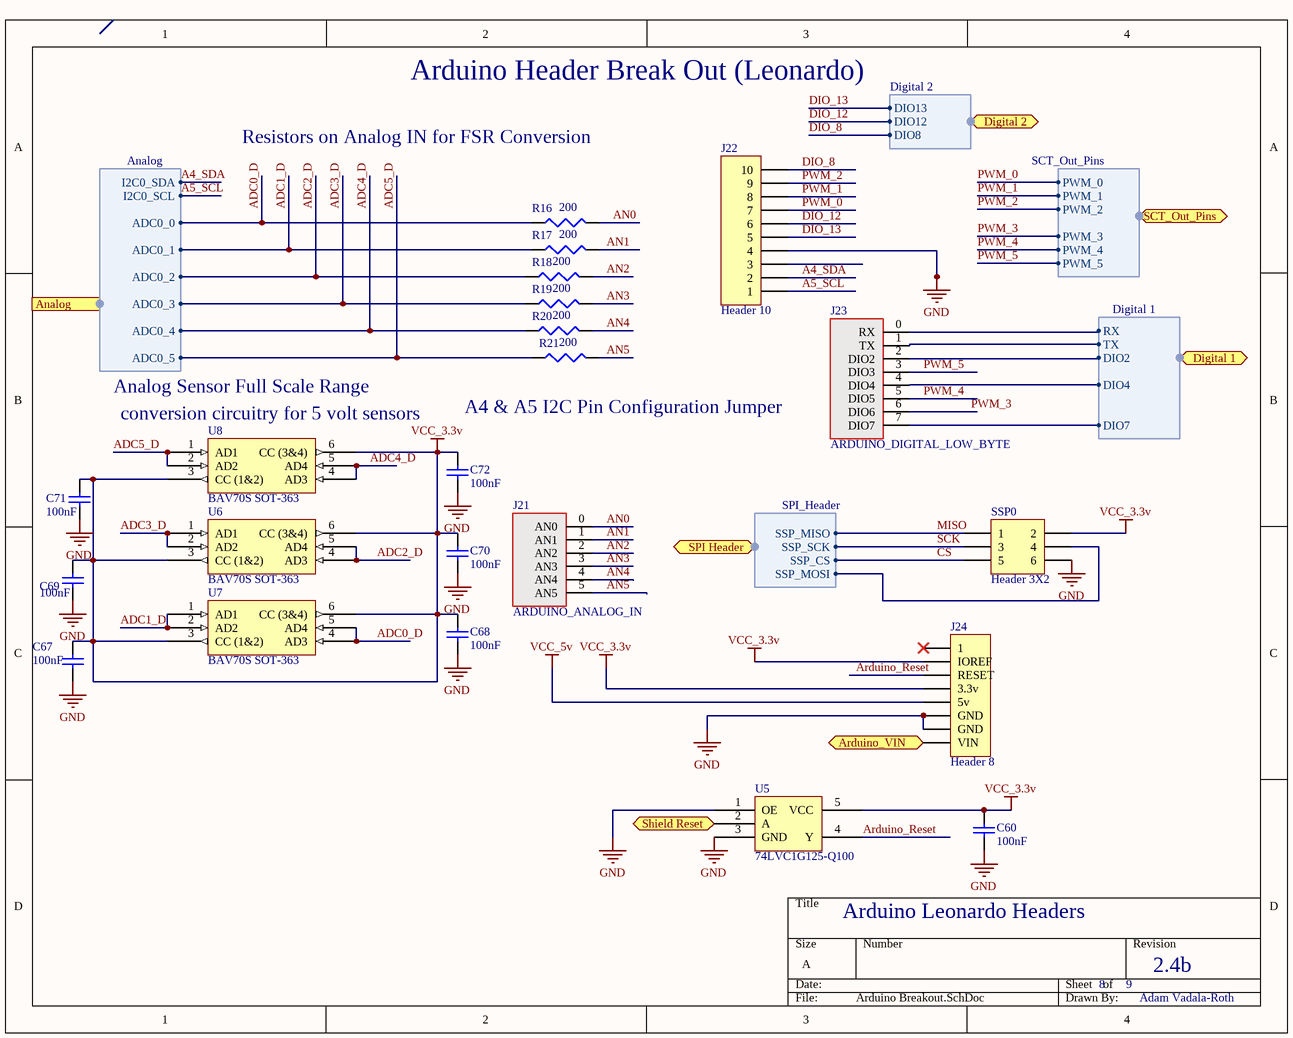
[diagram p4: Arduino Breakout.SchDoc]

### Parts
C60  value 100nF  [1608[0603]]  (hidden comment: Cap Semi)
C67  value 100nF  [1608[0603]]  (hidden comment: Cap Semi)
C68  value 100nF  [1608[0603]]  (hidden comment: Cap Semi)
C69  value 100nF  [1608[0603]]  (hidden comment: Cap Semi)
C70  value 100nF  [1608[0603]]  (hidden comment: Cap Semi)
C71  value 100nF  [1608[0603]]  (hidden comment: Cap Semi)
C72  value 100nF  [1608[0603]]  (hidden comment: Cap Semi)
J21  ARDUINO_ANALOG_IN  [HDR1X6]
J22  Header 10  [HDR1X10]
J23  ARDUINO_DIGITAL_LOW_BYTE  [HDR1X8]
J24  Header 8  [HDR1X8]
R16  value 200  [J1-0603]  (hidden comment: Res3)
R17  value 200  [J1-0603]  (hidden comment: Res3)
R18  value 200  [J1-0603]  (hidden comment: Res3)
R19  value 200  [J1-0603]  (hidden comment: Res3)
R20  value 200  [J1-0603]  (hidden comment: Res3)
R21  value 200  [J1-0603]  (hidden comment: Res3)
SSP0  Header 3X2  [HDR2X3]
U5  74LVC1G125-Q100  [74LVC1G125-Q100]
U6  BAV70S SOT-363  [BAV70S_SOT363]
U7  BAV70S SOT-363  [BAV70S_SOT363]
U8  BAV70S SOT-363  [BAV70S_SOT363]

### Ports
Analog (harness Analog), Arduino_VIN, Digital 1 (harness Digital 1), Digital 2 (harness Digital 2), SCT_Out_Pins (harness SCT_Out_Pins), Shield Reset, SPI Header (harness SPI_Header)

### Harnesses
Analog: ADC0_0, ADC0_1, ADC0_2, ADC0_3, ADC0_4, ADC0_5, I2C0_SCL, I2C0_SDA
Digital 1: TX, RX, DIO2, DIO4, DIO7
Digital 2: DIO8, DIO13, DIO12
SCT_Out_Pins: PWM_0, PWM_1, PWM_2, PWM_3, PWM_4, PWM_5
SPI_Header: SSP_CS, SSP_MOSI, SSP_MISO, SSP_SCK

### Nets
GND: C60.2 C67.2 C68.2 C69.2 C70.2 C71.2 C72.2 J22.4 J24.6(GND) J24.7(GND) SSP0.6 U5.1(OE) U5.3(GND)
VCC_3.3v: C60.1 C67.1 C68.1 C69.1 C70.1 C71.1 C72.1 J24.2(IOREF) J24.4(3.3v) SSP0.2 U5.5(VCC) U6.3(CC_(1&2)) U6.6(CC_(3&4)) U7.3(CC_(1&2)) U7.6(CC_(3&4)) U8.3(CC_(1&2)) U8.6(CC_(3&4))
VCC_5v: J24.5(5v)
VCC_IN: J24.8(VIN) ; port Arduino_VIN
A4_SDA: J22.2 ; port Analog.I2C0_SDA
A5_SCL: J22.1 ; port Analog.I2C0_SCL
ADC0_D: R16.1 U7.4(AD3) U7.5(AD4) ; port Analog.ADC0_0  [project net ADC0_0]
ADC1_D: R17.1 U7.1(AD1) U7.2(AD2) ; port Analog.ADC0_1  [project net ADC0_1]
ADC2_D: R18.1 U6.4(AD3) U6.5(AD4) ; port Analog.ADC0_2  [project net ADC0_2]
ADC3_D: R19.1 U6.1(AD1) U6.2(AD2) ; port Analog.ADC0_3  [project net ADC0_3]
ADC4_D: R20.1 U8.4(AD3) U8.5(AD4) ; port Analog.ADC0_4  [project net ADC0_4]
ADC5_D: R21.1 U8.1(AD1) U8.2(AD2) ; port Analog.ADC0_5  [project net ADC0_5]
AN0: J21.0(AN0) R16.2
AN1: J21.1(AN1) R17.2
AN2: J21.2(AN2) R18.2
AN3: J21.3(AN3) R19.2
AN4: J21.4(AN4) R20.2
AN5: J21.5(AN5) R21.2
Arduino_Reset: J24.3(RESET) U5.4(Y)
CS: SSP0.5 ; port SPI Header.SSP_CS
DIO2: J23.2(DIO2) ; port Digital 1.DIO2
DIO4: J23.4(DIO4) ; port Digital 1.DIO4
DIO7: J23.7(DIO7) ; port Digital 1.DIO7
DIO_8: J22.10 ; port Digital 2.DIO8  [project net DIO8]
DIO_12: J22.6 ; port Digital 2.DIO12  [project net DIO12]
DIO_13: J22.5 ; port Digital 2.DIO13  [project net DIO13]
GPIO1_6_TXD: J23.1(TX) ; port Digital 1.TX
GPIO1_7_RXD: J23.0(RX) ; port Digital 1.RX
MISO: SSP0.1 ; port SPI Header.SSP_MISO
PWM_0: J22.7 ; port SCT_Out_Pins.PWM_0
PWM_1: J22.8 ; port SCT_Out_Pins.PWM_1
PWM_2: J22.9 ; port SCT_Out_Pins.PWM_2
PWM_3: J23.6(DIO6) ; port SCT_Out_Pins.PWM_3
PWM_4: J23.5(DIO5) ; port SCT_Out_Pins.PWM_4
PWM_5: J23.3(DIO3) ; port SCT_Out_Pins.PWM_5
RESET: U5.2(A) ; port Shield Reset
SCK: SSP0.3 ; port SPI Header.SSP_SCK
SSP_MOSI: SSP0.4 ; port SPI Header.SSP_MOSI

Not connected (* = marked no-connect by the designer): J22 3; J24 1*

### Notes on the sheet
- Arduino Header Break Out (Leonardo)
- Resistors on Analog IN for FSR Conversion
- Analog Sensor Full Scale Range
- conversion circuitry for 5 volt sensors
- A4 & A5 I2C Pin Configuration Jumper

### Library data of the parts
C60 C67-C72 = Cap Semi: Capacitor (Semiconductor SIM Model); Published: 8-Jun-2000; LatestRevisionDate: 29-May-2009; LatestRevisionNote: IPC-7351 Footprint Added.; PackageReference: C1206; Publisher: Altium Limited; PackageDescription: Chip Capacitor
J21 = ARDUINO_ANALOG_IN: 6-pin socket; pin to pad: 0>1 1>2 2>3 3>4 4>5 5>6
J22 = Header 10: Header, 10-Pin; LatestRevisionDate: 17-Jul-2002; LatestRevisionNote: Re-released for DXP Platform.; Publisher: Altium Limited
J23 = ARDUINO_DIGITAL_LOW_BYTE: 8-pin socket; pin to pad: 0>1 1>2 2>3 3>4 4>5 5>6 6>7 7>8
J24 = Header 8: Header, 8-Pin; LatestRevisionDate: 17-Jul-2002; LatestRevisionNote: Re-released for DXP Platform.; Publisher: Altium Limited
R16-R21 = Res3: Resistor; Published: 8-Jun-2000; LatestRevisionDate: 29-May-2009; LatestRevisionNote: IPC-7351 Footprint Added.; PackageReference: J1-0603; Publisher: Altium Limited; PackageDescription: Chip Resistor
SSP0 = Header 3X2: Header, 3-Pin, Dual row; LatestRevisionDate: 17-Jul-2002; LatestRevisionNote: Re-released for DXP Platform.; Publisher: Altium Limited

## Sheet AHD Ethernet.SchDoc: Ethernet Section
size B; DrawnBy: Adam Vadala-Roth; DocumentNumber: 5; Revision: 2.4b; SheetNumber: 5; SheetTotal: 9
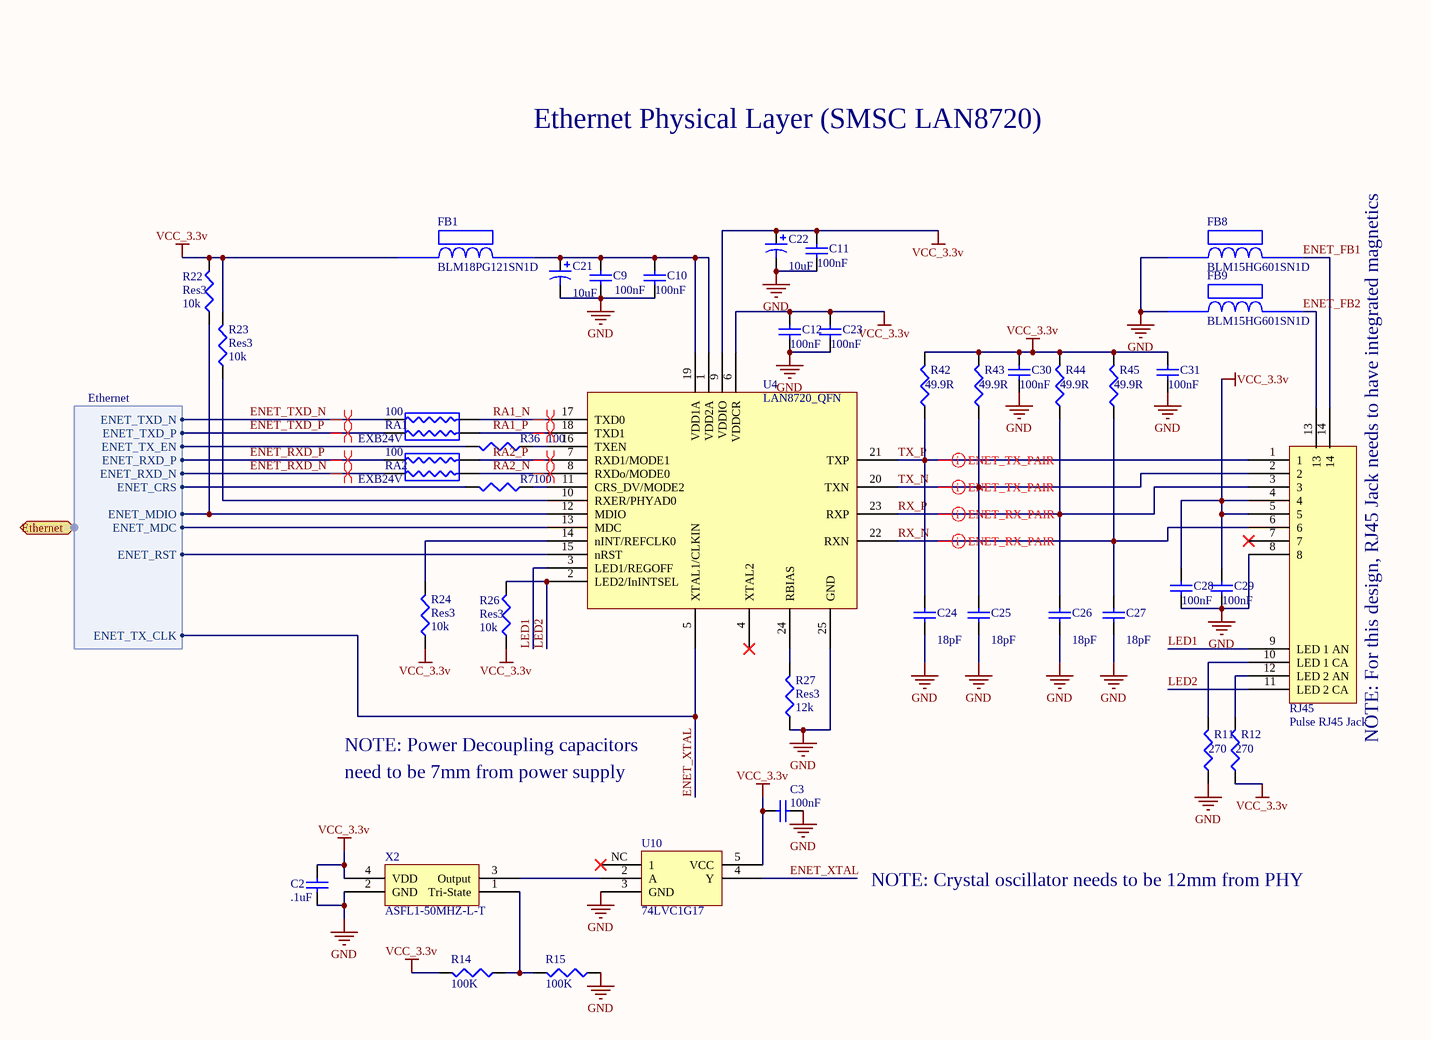
[diagram p5: AHD Ethernet.SchDoc]

### Parts
C2  value .1uF  [1608[0603]]  (hidden comment: Cap Semi)
C3  value 100nF  [1608[0603]]  (hidden comment: Cap Semi)
C9  value 100nF  [1608[0603]]  (hidden comment: Cap Semi)
C10  value 100nF  [1608[0603]]  (hidden comment: Cap Semi)
C11  value 100nF  [1608[0603]]  (hidden comment: Cap Semi)
C12  value 100nF  [1608[0603]]  (hidden comment: Cap Semi)
C21  value 10uF  [CAPC1608L]  (hidden comment: Cap Pol3)
C22  value 10uF  [CAPC1608L]  (hidden comment: Cap Pol3)
C23  value 100nF  [1608[0603]]  (hidden comment: Cap Semi)
C24  value 18pF  [1608[0603]]  (hidden comment: Cap Semi)
C25  value 18pF  [1608[0603]]  (hidden comment: Cap Semi)
C26  value 18pF  [1608[0603]]  (hidden comment: Cap Semi)
C27  value 18pF  [1608[0603]]  (hidden comment: Cap Semi)
C28  value 100nF  [1608[0603]]  (hidden comment: Cap Semi)
C29  value 100nF  [1608[0603]]  (hidden comment: Cap Semi)
C30  value 100nF  [1608[0603]]  (hidden comment: Cap Semi)
C31  value 100nF  [1608[0603]]  (hidden comment: Cap Semi)
FB1  BLM18PG121SN1D  [BLM18PG121SN1D]
FB8  BLM15HG601SN1D  [BLM18PG121SN1D]
FB9  BLM15HG601SN1D  [BLM18PG121SN1D]
R7  value 100  [J1-0603]  (hidden comment: Res3)
R11  value 270  [J1-0603]  (hidden comment: Res3)
R12  value 270  [J1-0603]  (hidden comment: Res3)
R14  value 100K  [J1-0603]  (hidden comment: Res3)
R15  value 100K  [J1-0603]  (hidden comment: Res3)
R22  Res3  value 10k  [J1-0603]
R23  Res3  value 10k  [J1-0603]
R24  Res3  value 10k  [J1-0603]
R26  Res3  value 10k  [J1-0603]
R27  Res3  value 12k  [J1-0603]
R36  value 100  [J1-0603]  (hidden comment: Res3)
R42  value 49.9R  [J1-0603]  (hidden comment: Res3)
R43  value 49.9R  [J1-0603]  (hidden comment: Res3)
R44  value 49.9R  [J1-0603]  (hidden comment: Res3)
R45  value 49.9R  [J1-0603]  (hidden comment: Res3)
RA1  EXB24V  value 100  [EXB24V - Res Array x2]
RA2  EXB24V  value 100  [EXB24V - Res Array x2]
RJ45  Pulse RJ45 Jack  [J0006D21BNL]
U4  LAN8720_QFN  [LAN8720_QFN]
U10  74LVC1G17  [74LVC1G17]
X2  ASFL1-50MHZ-L-T  [ASFL1-50MHZ-L-T]

### Ports
Ethernet (harness Ethernet)

### Harnesses
Ethernet: ENET_RXD_P, ENET_TX_EN, ENET_RST, ENET_TXD_P, ENET_MDC, ENET_RXD_N, ENET_CRS, ENET_MDIO, ENET_TXD_N, ENET_TX_CLK

### Nets
GND: C2.1 C3.1 C9.1 C10.1 C11.1 C12.1 C21.2 C22.2 C23.1 C24.1 C25.1 C26.1 C27.1 C28.1 C29.1 C30.1 C31.1 FB8.1 FB9.1 R11.1 R15.1 R27.1 RJ45.8 U4.25(GND) U10.3(GND) X2.2(GND)
VCC_3.3v: C2.2 C3.2 C11.2 C12.2 C22.1 C23.2 C28.2 C29.2 C30.2 C31.2 FB1.1 R12.1 R14.2 R22.2 R23.2 R24.1 R26.1 R42.2 R43.2 R44.2 R45.2 RJ45.4 RJ45.5 U4.6(VDDCR) U4.9(VDDIO) U10.5(VCC) X2.4(VDD)
ENET_CRS: R7.2 ; port Ethernet.ENET_CRS
ENET_FB1: FB8.2 RJ45.14
ENET_FB2: FB9.2 RJ45.13
ENET_MDC_NET: U4.13(MDC) ; port Ethernet.ENET_MDC
ENET_MDIO: R22.1 U4.12(MDIO) ; port Ethernet.ENET_MDIO
ENET_RST: U4.15(nRST) ; port Ethernet.ENET_RST
ENET_RXD_N: RA2.1 ; port Ethernet.ENET_RXD_N
ENET_RXD_P: RA2.3 ; port Ethernet.ENET_RXD_P
ENET_TX_EN: R36.2 ; port Ethernet.ENET_TX_EN
ENET_TXD_N: RA1.3 ; port Ethernet.ENET_TXD_N
ENET_TXD_P: RA1.1 ; port Ethernet.ENET_TXD_P
ENET_XTAL: U4.5(XTAL1/CLKIN) U10.4(Y) ; port Ethernet.ENET_TX_CLK  [project net ENET_TX_CLK]
LED1: RJ45.9(LED_1_AN) U4.3(LED1/REGOFF)
LED2: R26.2 RJ45.11(LED_2_CA) U4.2(LED2/InINTSEL)
RA1_N: RA1.4 U4.17(TXD0)
RA1_P: RA1.2 U4.18(TXD1)
RA2_N: RA2.2 U4.8(RXDo/MODE0)
RA2_P: RA2.4 U4.7(RXD1/MODE1)
RX_N: C27.2 R45.1 RJ45.6 U4.22(RXN)
RX_P: C26.2 R44.1 RJ45.3 U4.23(RXP)
TX_N: C25.2 R43.1 RJ45.2 U4.20(TXN)
TX_P: C24.2 R42.1 RJ45.1 U4.21(TXP)
NetC9_2: C9.2 C10.2 C21.1 FB1.2 U4.1(VDD2A) U4.19(VDD1A)
NetR7_1: R7.1 U4.11(CRS_DV/MODE2)
NetR11_2: R11.2 RJ45.10(LED_1_CA)
NetR12_2: R12.2 RJ45.12(LED_2_AN)
NetR14_1: R14.1 R15.2 X2.1(Tri-State)
NetR23_1: R23.1 U4.10(RXER/PHYAD0)
NetR24_2: R24.2 U4.14(nINT/REFCLK0)
NetR27_2: R27.2 U4.24(RBIAS)
NetR36_1: R36.1 U4.16(TXEN)
NetU10_2: U10.2(A) X2.3(Output)

Not connected (* = marked no-connect by the designer): RJ45 7*; U4 4(XTAL2)*; U10 NC(1)*

### Layout directives
differential pair: ENET_RXD_N, ENET_RXD_P, ENET_TXD_N, ENET_TXD_P, RA1_N, RA1_P, RA2_N, RA2_P, RX_N, RX_P, TX_N, TX_P

### Notes on the sheet
- Ethernet Physical Layer (SMSC LAN8720)
- (near RJ45) NOTE: For this design, RJ45 Jack needs to have integrated magnetics
- NOTE: Power Decoupling capacitors
- need to be 7mm from power supply
- NOTE: Crystal oscillator needs to be 12mm from PHY

### Library data of the parts
C2 C3 C9-C12 C23-C31 = Cap Semi: Capacitor (Semiconductor SIM Model); Published: 8-Jun-2000; LatestRevisionDate: 29-May-2009; LatestRevisionNote: IPC-7351 Footprint Added.; PackageReference: C1206; Publisher: Altium Limited; PackageDescription: Chip Capacitor
C21 C22 = Cap Pol3: Polarized Capacitor (Surface Mount); Published: 8-Jun-2000; LatestRevisionDate: 29-May-2009; LatestRevisionNote: IPC-7351 Footprint Added.; PackageReference: C0805; Publisher: Altium Limited; PackageDescription: Chip Capacitor
R7 R11 R12 R14 R15 R22-R24 R26 R27 R36 R42-R45 = Res3: Resistor; Published: 8-Jun-2000; LatestRevisionDate: 29-May-2009; LatestRevisionNote: IPC-7351 Footprint Added.; PackageReference: J1-0603; Publisher: Altium Limited; PackageDescription: Chip Resistor
RA1 RA2 = EXB24V - Res Array x2
RJ45 = Pulse RJ45_ICM_LED_Jack
U4 = LAN8720 QFN

## Sheet Crystal_Reset_Boot.SchDoc: LPC4330 Reset / Crystal / JTAG/ BOOT / RTC
size A; DrawnBy: Adam Vadala-Roth; DocumentNumber: 3; Revision: 2.4b; SheetNumber: 3; SheetTotal: 9
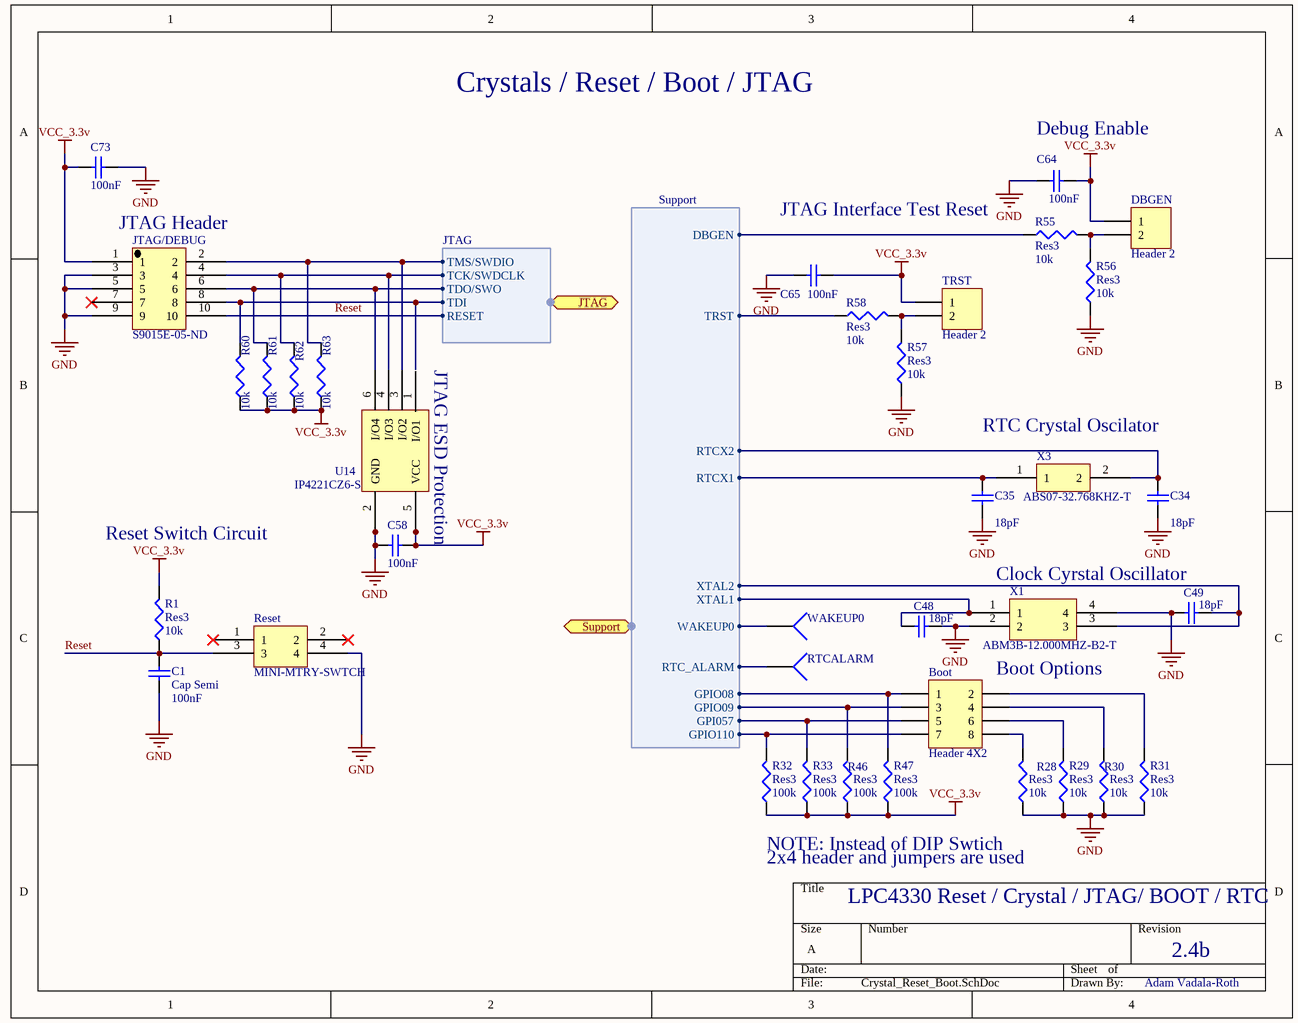
[diagram p6: Crystal_Reset_Boot.SchDoc]

### Parts
Boot  Header 4X2  [HDR2X4]
C1  Cap Semi  C1: 100nF  [CAPC1608L]
C34  value 18pF  [1608[0603]]  (hidden comment: Cap Semi)
C35  value 18pF  [1608[0603]]  (hidden comment: Cap Semi)
C48  value 18pF  [1608[0603]]  (hidden comment: Cap Semi)
C49  value 18pF  [1608[0603]]  (hidden comment: Cap Semi)
C58  C1: 100nF  [CAPC1608L]  (hidden comment: Cap Semi)
C64  C1: 100nF  [CAPC1608L]  (hidden comment: Cap Semi)
C65  C1: 100nF  [CAPC1608L]  (hidden comment: Cap Semi)
C73  C1: 100nF  [CAPC1608L]  (hidden comment: Cap Semi)
DBGEN  Header 2  [HDR1X2]
JTAG/DEBUG  S9015E-05-ND  [S9015E-05-ND]
R1  Res3  value 10k  [J1-0603]
R28  Res3  value 10k  [J1-0603]
R29  Res3  value 10k  [J1-0603]
R30  Res3  value 10k  [J1-0603]
R31  Res3  value 10k  [J1-0603]
R32  Res3  value 100k  [J1-0603]
R33  Res3  value 100k  [J1-0603]
R46  Res3  value 100k  [J1-0603]
R47  Res3  value 100k  [J1-0603]
R55  Res3  value 10k  [J1-0603]
R56  Res3  value 10k  [J1-0603]
R57  Res3  value 10k  [J1-0603]
R58  Res3  value 10k  [J1-0603]
R60  value 10k  [J1-0603]  (hidden comment: Res3)
R61  value 10k  [J1-0603]  (hidden comment: Res3)
R62  value 10k  [J1-0603]  (hidden comment: Res3)
R63  value 10k  [J1-0603]  (hidden comment: Res3)
Reset  MINI-MTRY-SWTCH  [Momentary Switch]
RTCALARM  Socket  [PIN1]  (value not drawn)
TRST  Header 2  [HDR1X2]
U14  IP4221CZ6-S  [IP4221CZ6-S]
WAKEUP0  Socket  [PIN1]  (value not drawn)
X1  ABM3B-12.000MHZ-B2-T  [ABM3B-12.000MHZ-B2-T]
X3  ABS07-32.768KHZ-T  [ABS07-32.768KHZ-T]

### Ports
JTAG (harness JTAG), Support (harness Support)

### Harnesses
JTAG: TDI, TDO/SWO, TCK/SWDCLK, TMS/SWDIO, RESET
Support: GPIO08, GPIO09, GPI057, GPIO110, RTC_ALARM, WAKEUP0, XTAL2, XTAL1, RTCX2, RTCX1, TRST, DBGEN

### Nets
GND: C1.1 C34.1 C35.1 C48.1 C49.2 C58.1 C64.1 C65.1 C73.2 JTAG/DEBUG.3 JTAG/DEBUG.5 JTAG/DEBUG.9 R28.1 R29.1 R30.1 R31.1 R56.1 R57.1 Reset.4 U14.2(GND) X1.2 X1.4
VCC_3.3v: C58.2 C64.2 C65.2 C73.1 DBGEN.1 JTAG/DEBUG.1 R1.2 R32.1 R33.1 R46.1 R47.1 R60.1 R61.1 R62.1 R63.1 TRST.1 U14.5(VCC)
DBGEN: R55.1 ; port Support.DBGEN
GPIO08_NET: Boot.1 R47.2 ; port Support.GPIO08
GPIO09_NET: Boot.3 R46.2 ; port Support.GPIO09
GPIO57_NET: Boot.5 R33.2 ; port Support.GPI057
GPIO110_NET: Boot.7 R32.2 ; port Support.GPIO110
RESET: C1.2 JTAG/DEBUG.10 R1.1 Reset.3 ; port JTAG.RESET
RTC_ALARM: RTCALARM.1 ; port Support.RTC_ALARM
RTCX1: C35.2 X3.1 ; port Support.RTCX1
RTCX2: C34.2 X3.2 ; port Support.RTCX2
TCK_SWDCLK: JTAG/DEBUG.4 R62.2 U14.4(I/O3) ; port JTAG.TCK/SWDCLK
TDI: JTAG/DEBUG.8 R60.2 ; port JTAG.TDI
TDO_SWO: JTAG/DEBUG.6 R61.2 U14.6(I/O4) ; port JTAG.TDO/SWO
TMS_SWDIO: JTAG/DEBUG.2 R63.2 U14.3(I/O2) ; port JTAG.TMS/SWDIO
TRST: R58.1 ; port Support.TRST
WAKEUP0: WAKEUP0.1 ; port Support.WAKEUP0
XTAL1: C48.2 X1.1 ; port Support.XTAL1
XTAL2: C49.1 X1.3 ; port Support.XTAL2
NetBoot_2: Boot.2 R31.2
NetBoot_4: Boot.4 R30.2
NetBoot_6: Boot.6 R29.2
NetBoot_8: Boot.8 R28.2
NetDBGEN_2: DBGEN.2 R55.2 R56.2
NetR57_2: R57.2 R58.2 TRST.2

Not connected (* = marked no-connect by the designer): JTAG/DEBUG 7*; Reset 1* 2*; U14 1(I/O1)

### Notes on the sheet
- Crystals / Reset / Boot / JTAG
- (near C64) Debug Enable
- (near JTAG/DEBUG) JTAG Header
- (near R55) JTAG Interface Test Reset
- (near U14) JTAG ESD Protection
- RTC Crystal Oscilator
- Reset Switch Circuit
- Clock Cyrstal Oscillator
- Boot Options
- NOTE: Instead of DIP Swtich
- 2x4 header and jumpers are used
- Adam Vadala-Roth

### Library data of the parts
Boot = Header 4X2: Header, 4-Pin, Dual row; LatestRevisionDate: 17-Jul-2002; LatestRevisionNote: Re-released for DXP Platform.; Publisher: Altium Limited
C1 C34 C35 C48 C49 C58 C64 C65 C73 = Cap Semi: Capacitor (Semiconductor SIM Model); Published: 8-Jun-2000; LatestRevisionDate: 29-May-2009; LatestRevisionNote: IPC-7351 Footprint Added.; PackageReference: C1206; Publisher: Altium Limited; PackageDescription: Chip Capacitor
DBGEN TRST = Header 2: Header, 2-Pin; LatestRevisionDate: 17-Jul-2002; LatestRevisionNote: Re-released for DXP Platform.; Publisher: Altium Limited
R1 R28-R33 R46 R47 R55-R58 R60-R63 = Res3: Resistor; Published: 8-Jun-2000; LatestRevisionDate: 29-May-2009; LatestRevisionNote: IPC-7351 Footprint Added.; PackageReference: J1-0603; Publisher: Altium Limited; PackageDescription: Chip Resistor
Reset = Mini Momemtary Switch
X3 = ABS07-32.768KHZ-T: ABS07-32.768KHZ-T RTC Crystal Oscillator
RTCALARM WAKEUP0 = Socket: LatestRevisionDate: 17-Jul-2002; LatestRevisionNote: Re-released for DXP Platform.; Publisher: Altium Limited

## Sheet AHD USB Section.SchDoc: USB Section
size A; DrawnBy: Adam Vadala-Roth; DocumentNumber: 6; Revision: 2.4b; SheetNumber: 6; SheetTotal: 9
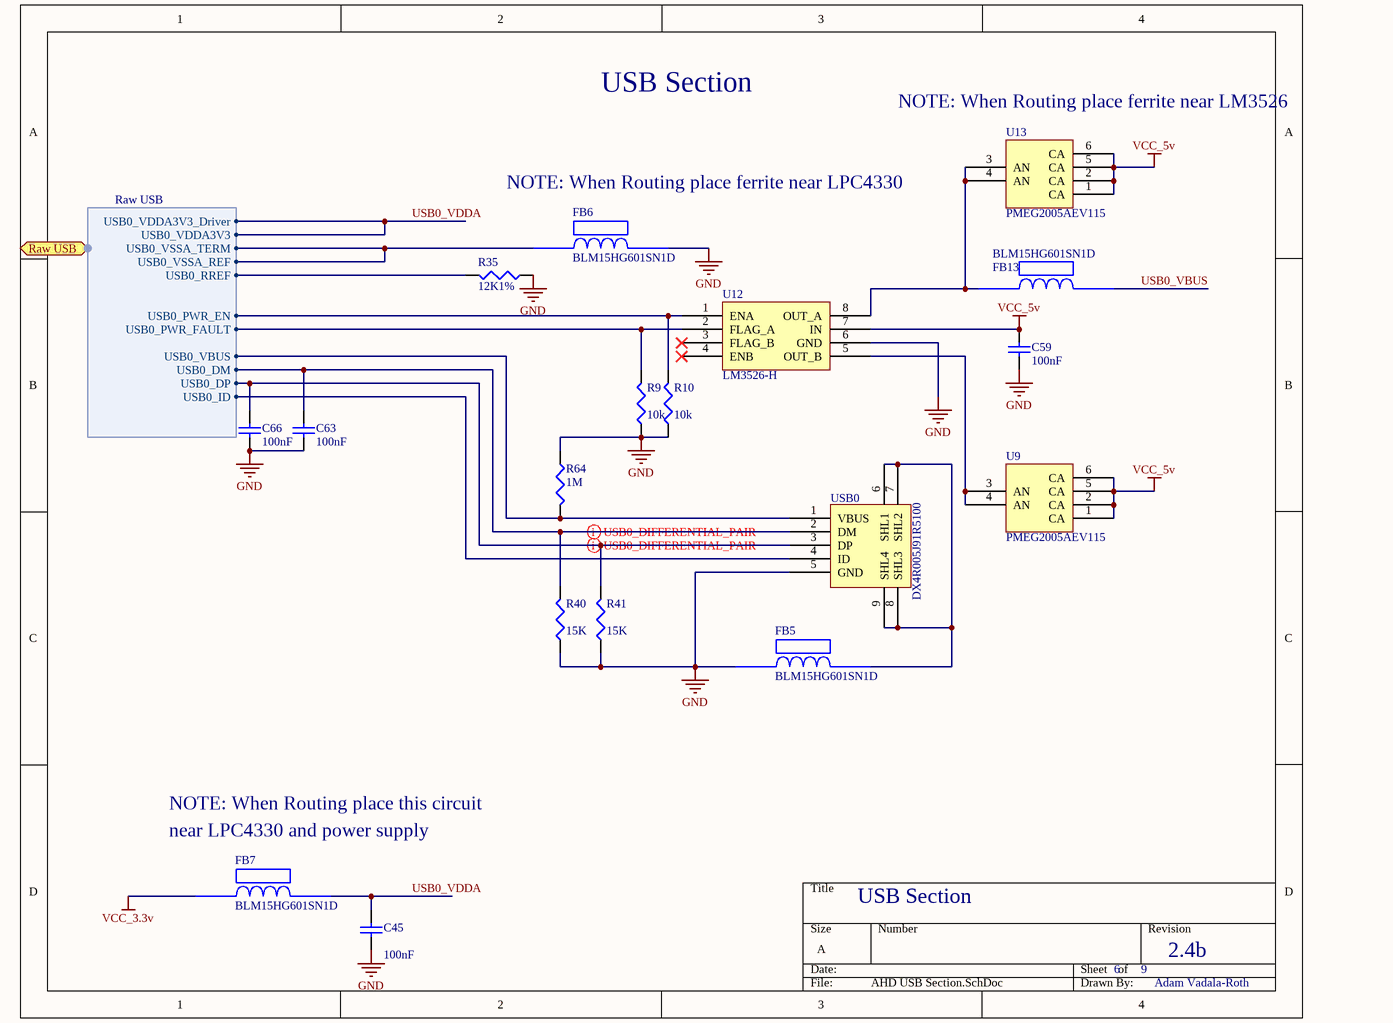
[diagram p7: AHD USB Section.SchDoc]

### Parts
C45  C1: 100nF  [CAPC1608L]  (hidden comment: Cap Semi)
C59  C1: 100nF  [CAPC1608L]  (hidden comment: Cap Semi)
C63  C1: 100nF  [CAPC1608L]  (hidden comment: Cap Semi)
C66  C1: 100nF  [CAPC1608L]  (hidden comment: Cap Semi)
FB5  BLM15HG601SN1D  [BLM18PG121SN1D]
FB6  BLM15HG601SN1D  [BLM18PG121SN1D]
FB7  BLM15HG601SN1D  [BLM18PG121SN1D]
FB13  BLM15HG601SN1D  [BLM18PG121SN1D]
R9  value 10k  [J1-0603]  (hidden comment: Res3)
R10  value 10k  [J1-0603]  (hidden comment: Res3)
R35  value 12K1%  [RESC1608L]  (hidden comment: Res3)
R40  value 15K  [J1-0603]  (hidden comment: Res3)
R41  value 15K  [J1-0603]  (hidden comment: Res3)
R64  value 1M  [J1-0603]  (hidden comment: Res3)
U9  PMEG2005AEV115  [PMEG2005AEV115]
U12  LM3526-H  [LM3526]
U13  PMEG2005AEV115  [PMEG2005AEV115]
USB0  DX4R005J91R5100  [Micro USB Circular Holes Only]

### Ports
Raw USB (harness Raw USB)

### Harnesses
Raw USB: USB0_VDDA3V3_Driver, USB0_VDDA3V3, USB0_VSSA_TERM, USB0_VSSA_REF, USB0_VBUS, USB0_DP, USB0_DM, USB0_ID, USB0_RREF, USB0_PWR_EN, USB0_PWR_FAULT

### Nets
GND: C45.2 C59.2 C63.2 C66.2 FB5.1 FB6.2 R9.1 R10.1 R35.1 R40.1 R41.1 R64.1 U12.6(GND) USB0.5(GND)
VCC_3.3v: FB7.1
VCC_5v: C59.1 U9.1(CA) U9.2(CA) U9.5(CA) U9.6(CA) U12.7(IN) U13.1(CA) U13.2(CA) U13.5(CA) U13.6(CA)
USB0__ID: USB0.4(ID) ; port Raw USB.USB0_ID
USB0__RREF: R35.2 ; port Raw USB.USB0_RREF
USB0_N: C63.1 R40.2 USB0.2(DM) ; port Raw USB.USB0_DM
USB0_P: C66.1 R41.2 USB0.3(DP) ; port Raw USB.USB0_DP
USB0_PPWR: R10.2 U12.1(ENA) ; port Raw USB.USB0_PWR_EN
USB0_PWR_FAULT: R9.2 U12.2(FLAG_A) ; port Raw USB.USB0_PWR_FAULT
USB0_VBUS: R64.2 USB0.1(VBUS) ; port Raw USB.USB0_VBUS
USB0_VBUS: FB13.2  [a separate net that carries the same name]
USB0_VDDA: C45.1 FB7.2 ; port Raw USB.USB0_VDDA3V3_Driver, port Raw USB.USB0_VDDA3V3
USB0_VSSA_REF: FB6.1 ; port Raw USB.USB0_VSSA_TERM, port Raw USB.USB0_VSSA_REF
NetFB5_2: FB5.2 USB0.6(SHL1) USB0.7(SHL2) USB0.8(SHL3) USB0.9(SHL4)
NetFB13_1: FB13.1 U12.8(OUT_A) U13.3(AN) U13.4(AN)
NetU9_3: U9.3(AN) U9.4(AN) U12.5(OUT_B)

Not connected (* = marked no-connect by the designer): U12 3(FLAG_B)* 4(ENB)*

### Layout directives
differential pair: USB0_N, USB0_P

### Notes on the sheet
- USB Section
- (near U13) NOTE: When Routing place ferrite near LM3526
- NOTE: When Routing place ferrite near LPC4330
- NOTE: When Routing place this circuit
- near LPC4330 and power supply

### Library data of the parts
C45 C59 C63 C66 = Cap Semi: Capacitor (Semiconductor SIM Model); Published: 8-Jun-2000; LatestRevisionDate: 29-May-2009; LatestRevisionNote: IPC-7351 Footprint Added.; PackageReference: C1206; Publisher: Altium Limited; PackageDescription: Chip Capacitor
R9 R10 R35 R40 R41 R64 = Res3: Resistor; Published: 8-Jun-2000; LatestRevisionDate: 29-May-2009; LatestRevisionNote: IPC-7351 Footprint Added.; PackageReference: J1-0603; Publisher: Altium Limited; PackageDescription: Chip Resistor
U12 = LM3526
USB0 = Micro USB: Micro USB Jack B

## Sheet Bowler Debug LED.SchDoc: Bowler Server Debug LED
size A; DrawnBy: Adam Vadala-Roth; Engineer: Adam Vadala-Roth; DocumentNumber: 7; Revision: 2.4b; SheetNumber: 7; SheetTotal: 9
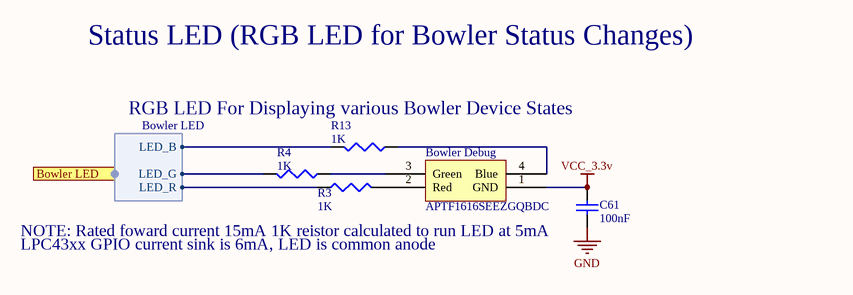
[diagram p8: Bowler Debug LED.SchDoc]

### Parts
Bowler_Debug  APTF1616SEEZGQBDC  [RGB LED APTF1616SEEZGQBDC]
C61  C1: 100nF  [CAPC1608L]  (hidden comment: Cap Semi)
R3  value 1K  [J1-0603]  (hidden comment: Res3)
R4  value 1K  [J1-0603]  (hidden comment: Res3)
R13  value 1K  [J1-0603]  (hidden comment: Res3)

### Ports
Bowler LED (harness Bowler LED)

### Harnesses
Bowler LED: LED_R, LED_G, LED_B

### Nets
GND: C61.1
VCC_3.3v: Bowler_Debug.1(GND) C61.2
LED_B: R13.2 ; port Bowler LED.LED_B
LED_G: R4.2 ; port Bowler LED.LED_G
LED_R: R3.1 ; port Bowler LED.LED_R
NetBowler_Debug_2: Bowler_Debug.2(Red) R3.2
NetBowler_Debug_3: Bowler_Debug.3(Green) R4.1
NetBowler_Debug_4: Bowler_Debug.4(Blue) R13.1

### Notes on the sheet
- Status LED (RGB LED for Bowler Status Changes)
- (near R13) RGB LED For Displaying various Bowler Device States
- (near C61) NOTE: Rated foward current 15mA 1K reistor calculated to run LED at 5mA
- LPC43xx GPIO current sink is 6mA, LED is common anode

### Library data of the parts
Bowler_Debug = RGB LED APTF1616SEEZGQBDC: RGB LED
C61 = Cap Semi: Capacitor (Semiconductor SIM Model); Published: 8-Jun-2000; LatestRevisionDate: 29-May-2009; LatestRevisionNote: IPC-7351 Footprint Added.; PackageReference: C1206; Publisher: Altium Limited; PackageDescription: Chip Capacitor
R3 R4 R13 = Res3: Resistor; Published: 8-Jun-2000; LatestRevisionDate: 29-May-2009; LatestRevisionNote: IPC-7351 Footprint Added.; PackageReference: J1-0603; Publisher: Altium Limited; PackageDescription: Chip Resistor

## Sheet Additional Breakout.SchDoc: Additional Digital IO
size A; DrawnBy: Adam Vadala-Roth; DocumentNumber: 9; Revision: 2.4b; SheetNumber: 9; SheetTotal: 9
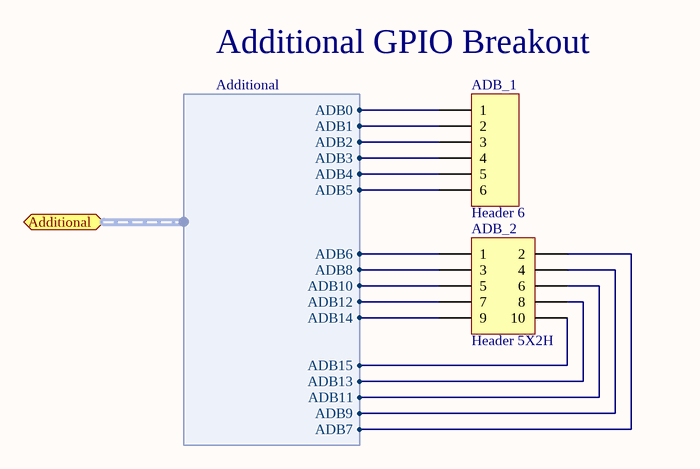
[diagram p9: Additional Breakout.SchDoc]

### Parts
ADB_1  Header 6  [HDR1X6]
ADB_2  Header 5X2H  [HDR2X5H]

### Ports
Additional (harness Additional)

### Harnesses
Additional: ADB0, ADB1, ADB2, ADB3, ADB4, ADB6, ADB5, ADB7, ADB9, ADB8, ADB10, ADB11, ADB12, ADB13, ADB14, ADB15

### Nets
ADB2: ADB_1.3 ; port Additional.ADB2
ADB3: ADB_1.4 ; port Additional.ADB3
ADB4: ADB_1.5 ; port Additional.ADB4
ADB5: ADB_1.6 ; port Additional.ADB5
ADB6: ADB_2.1 ; port Additional.ADB6
ADB7: ADB_2.2 ; port Additional.ADB7
ADB8: ADB_2.3 ; port Additional.ADB8
ADB9: ADB_2.4 ; port Additional.ADB9
ADB10: ADB_2.5 ; port Additional.ADB10
ADB11: ADB_2.6 ; port Additional.ADB11
ADB12: ADB_2.7 ; port Additional.ADB12
ADB13: ADB_2.8 ; port Additional.ADB13
ADB14: ADB_2.9 ; port Additional.ADB14
ADB15: ADB_2.10 ; port Additional.ADB15
I2C1_SCL: ADB_1.2 ; port Additional.ADB1
I2C1_SDA: ADB_1.1 ; port Additional.ADB0

### Notes on the sheet
- (near ADB_1) Additional GPIO Breakout

### Library data of the parts
ADB_1 = Header 6: Header, 6-Pin; LatestRevisionDate: 17-Jul-2002; LatestRevisionNote: Re-released for DXP Platform.; Publisher: Altium Limited
ADB_2 = Header 5X2H: Header, 5-Pin, Dual row, Right Angle; LatestRevisionDate: 17-Jul-2002; LatestRevisionNote: Re-released for DXP Platform.; Publisher: Altium Limited

## Nets that join several sheets
GND: Power (15 pins), Processor-LPC4330FBD144 (19 pins), Arduino Breakout (13 pins), AHD Ethernet (26 pins), Crystal_Reset_Boot (22 pins), AHD USB Section (14 pins), Bowler Debug LED (C61.1)
VCC_3.3v: Power (6 pins), Processor-LPC4330FBD144 (25 pins), Arduino Breakout (17 pins), AHD Ethernet (27 pins), Crystal_Reset_Boot (17 pins), AHD USB Section (FB7.1), Bowler Debug LED (Bowler_Debug.1 C61.2)
VCC_5v: Power (6 pins), Arduino Breakout (J24.5), AHD USB Section (10 pins)
VCC_IN: Power (5 pins), Arduino Breakout (J24.8)
A4_SDA: Processor-LPC4330FBD144 (U1.93), Arduino Breakout (J22.2)
A5_SCL: Processor-LPC4330FBD144 (U1.92), Arduino Breakout (J22.1)
ADB2: Processor-LPC4330FBD144 (U1.86), Additional Breakout (ADB_1.3)
ADB3: Processor-LPC4330FBD144 (U1.85), Additional Breakout (ADB_1.4)
ADB4: Processor-LPC4330FBD144 (U1.84), Additional Breakout (ADB_1.5)
ADB5: Processor-LPC4330FBD144 (U1.83), Additional Breakout (ADB_1.6)
ADB6: Processor-LPC4330FBD144 (U1.73), Additional Breakout (ADB_2.1)
ADB7: Processor-LPC4330FBD144 (U1.74), Additional Breakout (ADB_2.2)
ADB8: Processor-LPC4330FBD144 (U1.78), Additional Breakout (ADB_2.3)
ADB9: Processor-LPC4330FBD144 (U1.79), Additional Breakout (ADB_2.4)
ADB10: Processor-LPC4330FBD144 (U1.95), Additional Breakout (ADB_2.5)
ADB11: Processor-LPC4330FBD144 (U1.97), Additional Breakout (ADB_2.6)
ADB12: Processor-LPC4330FBD144 (U1.99), Additional Breakout (ADB_2.7)
ADB13: Processor-LPC4330FBD144 (U1.100), Additional Breakout (ADB_2.8)
ADB14: Processor-LPC4330FBD144 (U1.101), Additional Breakout (ADB_2.9)
ADB15: Processor-LPC4330FBD144 (U1.108), Additional Breakout (ADB_2.10)
ADC0_0: Processor-LPC4330FBD144 (U1.144), Arduino Breakout (R16.1 U7.4 U7.5)
ADC0_1: Processor-LPC4330FBD144 (U1.143), Arduino Breakout (R17.1 U7.1 U7.2)
ADC0_2: Processor-LPC4330FBD144 (U1.142), Arduino Breakout (R18.1 U6.4 U6.5)
ADC0_3: Processor-LPC4330FBD144 (U1.139), Arduino Breakout (R19.1 U6.1 U6.2)
ADC0_4: Processor-LPC4330FBD144 (U1.138), Arduino Breakout (R20.1 U8.4 U8.5)
ADC0_5: Processor-LPC4330FBD144 (U1.136), Arduino Breakout (R21.1 U8.1 U8.2)
CS: Processor-LPC4330FBD144 (U1.124), Arduino Breakout (SSP0.5)
DBGEN: Processor-LPC4330FBD144 (U1.28), Crystal_Reset_Boot (R55.1)
DIO2: Processor-LPC4330FBD144 (U1.1), Arduino Breakout (J23.2)
DIO4: Processor-LPC4330FBD144 (U1.2), Arduino Breakout (J23.4)
DIO7: Processor-LPC4330FBD144 (U1.6), Arduino Breakout (J23.7)
DIO8: Processor-LPC4330FBD144 (U1.8), Arduino Breakout (J22.10)
DIO12: Processor-LPC4330FBD144 (U1.3), Arduino Breakout (J22.6)
DIO13: Processor-LPC4330FBD144 (U1.7), Arduino Breakout (J22.5)
ENET_CRS: Processor-LPC4330FBD144 (U1.64), AHD Ethernet (R7.2)
ENET_MDC_NET: Processor-LPC4330FBD144 (U1.75), AHD Ethernet (U4.13)
ENET_MDIO: Processor-LPC4330FBD144 (U1.66), AHD Ethernet (R22.1 U4.12)
ENET_RST: Processor-LPC4330FBD144 (U1.38), AHD Ethernet (U4.15)
ENET_RXD_N: Processor-LPC4330FBD144 (U1.62), AHD Ethernet (RA2.1)
ENET_RXD_P: Processor-LPC4330FBD144 (U1.32), AHD Ethernet (RA2.3)
ENET_TX_CLK: Processor-LPC4330FBD144 (U1.68), AHD Ethernet (U4.5 U10.4)
ENET_TX_EN: Processor-LPC4330FBD144 (U1.34), AHD Ethernet (R36.2)
ENET_TXD_N: Processor-LPC4330FBD144 (U1.67), AHD Ethernet (RA1.3)
ENET_TXD_P: Processor-LPC4330FBD144 (U1.70), AHD Ethernet (RA1.1)
GPIO1_6_TXD: Processor-LPC4330FBD144 (U1.60), Arduino Breakout (J23.1)
GPIO1_7_RXD: Processor-LPC4330FBD144 (U1.61), Arduino Breakout (J23.0)
GPIO08_NET: Processor-LPC4330FBD144 (U1.42), Crystal_Reset_Boot (Boot.1 R47.2)
GPIO09_NET: Processor-LPC4330FBD144 (U1.43), Crystal_Reset_Boot (Boot.3 R46.2)
GPIO57_NET: Processor-LPC4330FBD144 (U1.98), Crystal_Reset_Boot (Boot.5 R33.2)
GPIO110_NET: Processor-LPC4330FBD144 (U1.102), Crystal_Reset_Boot (Boot.7 R32.2)
I2C1_SCL: Processor-LPC4330FBD144 (U1.87), Additional Breakout (ADB_1.2)
I2C1_SDA: Processor-LPC4330FBD144 (U1.88), Additional Breakout (ADB_1.1)
LED_B: Processor-LPC4330FBD144 (U1.105), Bowler Debug LED (R13.2)
LED_G: Processor-LPC4330FBD144 (U1.103), Bowler Debug LED (R4.2)
LED_R: Processor-LPC4330FBD144 (U1.104), Bowler Debug LED (R3.1)
MISO: Processor-LPC4330FBD144 (U1.122), Arduino Breakout (SSP0.1)
PWM_0: Processor-LPC4330FBD144 (U1.11), Arduino Breakout (J22.7)
PWM_1: Processor-LPC4330FBD144 (U1.10), Arduino Breakout (J22.8)
PWM_2: Processor-LPC4330FBD144 (U1.9), Arduino Breakout (J22.9)
PWM_3: Processor-LPC4330FBD144 (U1.134), Arduino Breakout (J23.6)
PWM_4: Processor-LPC4330FBD144 (U1.133), Arduino Breakout (J23.5)
PWM_5: Processor-LPC4330FBD144 (U1.132), Arduino Breakout (J23.3)
RESET: Processor-LPC4330FBD144 (U1.128), Arduino Breakout (U5.2), Crystal_Reset_Boot (C1.2 JTAG/DEBUG.10 R1.1 Reset.3)
RTC_ALARM: Processor-LPC4330FBD144 (U1.129), Crystal_Reset_Boot (RTCALARM.1)
RTCX1: Processor-LPC4330FBD144 (U1.125), Crystal_Reset_Boot (C35.2 X3.1)
RTCX2: Processor-LPC4330FBD144 (U1.126), Crystal_Reset_Boot (C34.2 X3.2)
SCK: Processor-LPC4330FBD144 (U1.118), Arduino Breakout (SSP0.3)
SSP_MOSI: Processor-LPC4330FBD144 (U1.123), Arduino Breakout (SSP0.4)
TCK_SWDCLK: Processor-LPC4330FBD144 (U1.27), Crystal_Reset_Boot (JTAG/DEBUG.4 R62.2 U14.4)
TDI: Processor-LPC4330FBD144 (U1.26), Crystal_Reset_Boot (JTAG/DEBUG.8 R60.2)
TDO_SWO: Processor-LPC4330FBD144 (U1.31), Crystal_Reset_Boot (JTAG/DEBUG.6 R61.2 U14.6)
TMS_SWDIO: Processor-LPC4330FBD144 (U1.30), Crystal_Reset_Boot (JTAG/DEBUG.2 R63.2 U14.3)
TRST: Processor-LPC4330FBD144 (U1.29), Crystal_Reset_Boot (R58.1)
USB0__ID: Processor-LPC4330FBD144 (U1.22), AHD USB Section (USB0.4)
USB0__RREF: Processor-LPC4330FBD144 (U1.24), AHD USB Section (R35.2)
USB0_N: Processor-LPC4330FBD144 (U1.20), AHD USB Section (C63.1 R40.2 USB0.2)
USB0_P: Processor-LPC4330FBD144 (U1.18), AHD USB Section (C66.1 R41.2 USB0.3)
USB0_PPWR: Processor-LPC4330FBD144 (U1.50), AHD USB Section (R10.2 U12.1)
USB0_PWR_FAULT: Processor-LPC4330FBD144 (U1.81), AHD USB Section (R9.2 U12.2)
USB0_VBUS: Processor-LPC4330FBD144 (U1.21), AHD USB Section (R64.2 USB0.1)
USB0_VDDA: Processor-LPC4330FBD144 (U1.16 U1.17), AHD USB Section (C45.1 FB7.2)
USB0_VSSA_REF: Processor-LPC4330FBD144 (U1.19 U1.23), AHD USB Section (FB6.1)
VDDA: Power (C46.1 C47.1 FB2.2), Processor-LPC4330FBD144 (U1.137)
VSSA: Power (C46.2 C47.2 FB3.2), Processor-LPC4330FBD144 (U1.135)
WAKEUP0: Processor-LPC4330FBD144 (U1.130), Crystal_Reset_Boot (WAKEUP0.1)
XTAL1: Processor-LPC4330FBD144 (U1.12), Crystal_Reset_Boot (C48.2 X1.1)
XTAL2: Processor-LPC4330FBD144 (U1.13), Crystal_Reset_Boot (C49.1 X1.3)